# EAGLE schematic Mainboard (EAGLE 9.0.1)

## Sheet 1 of 4: ADC
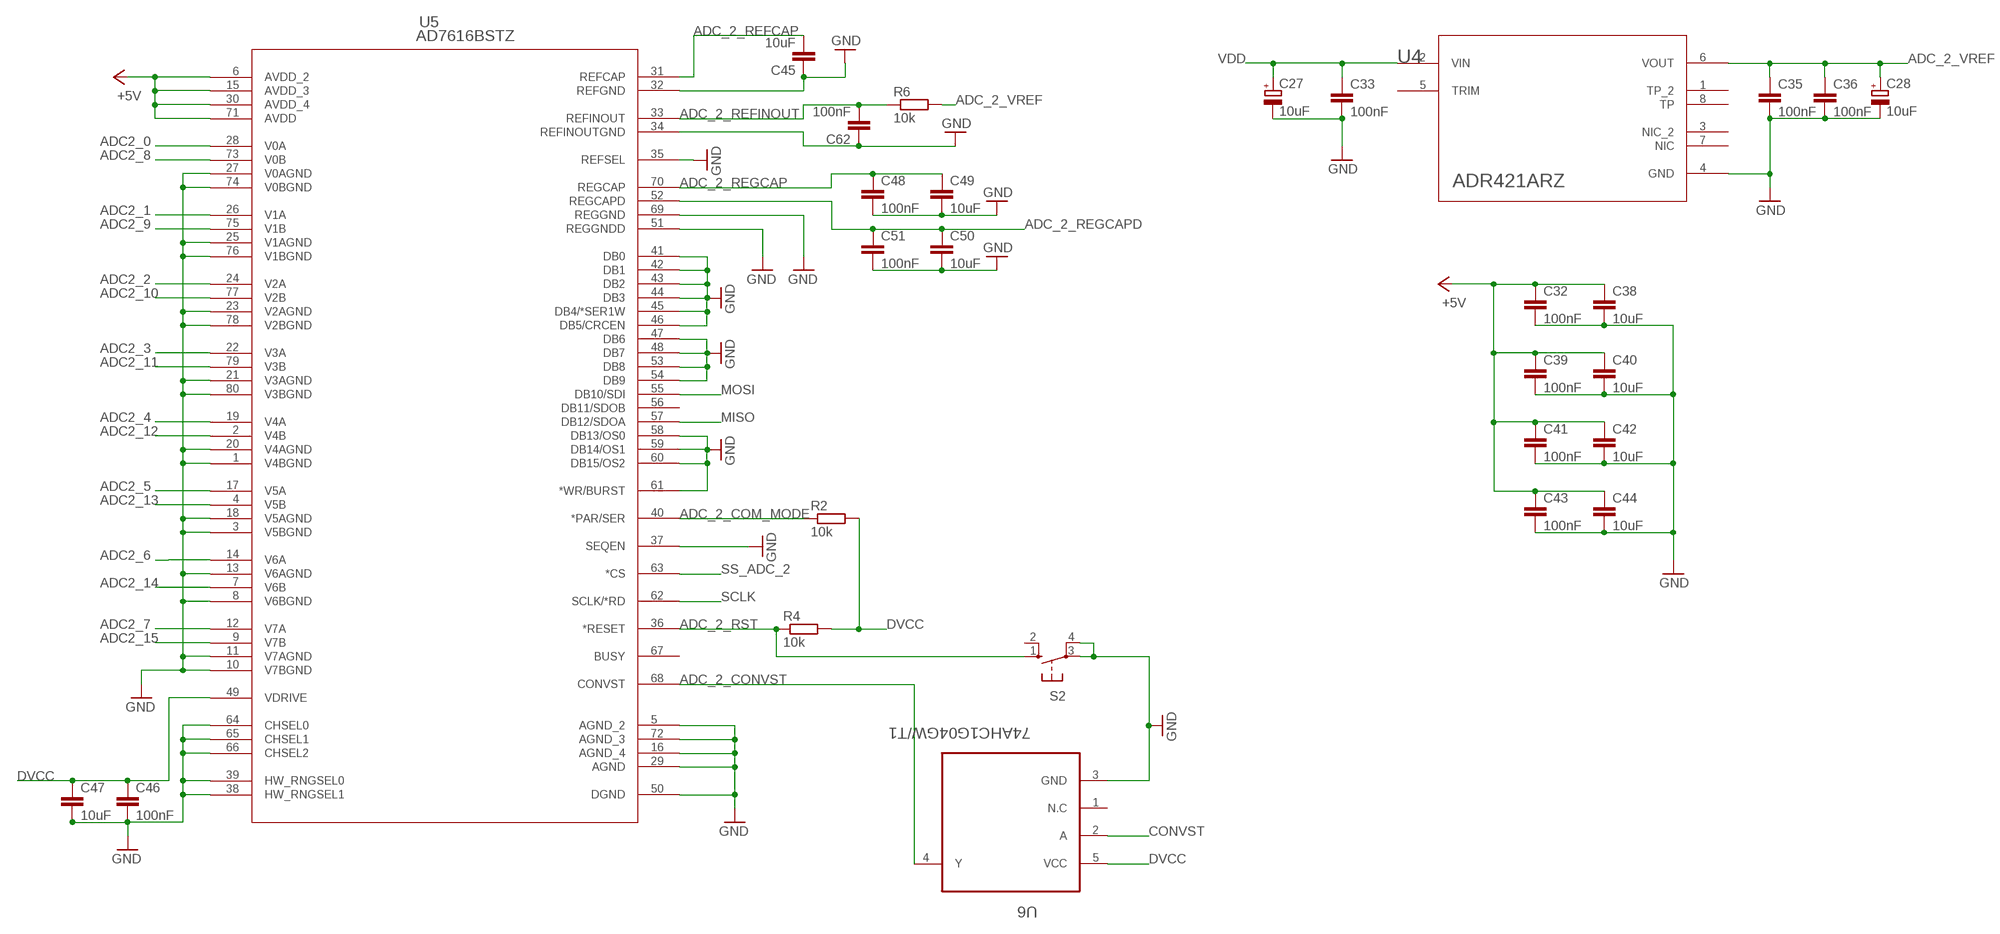
[diagram p0: schematic, sheet 1, part 1 of 2]
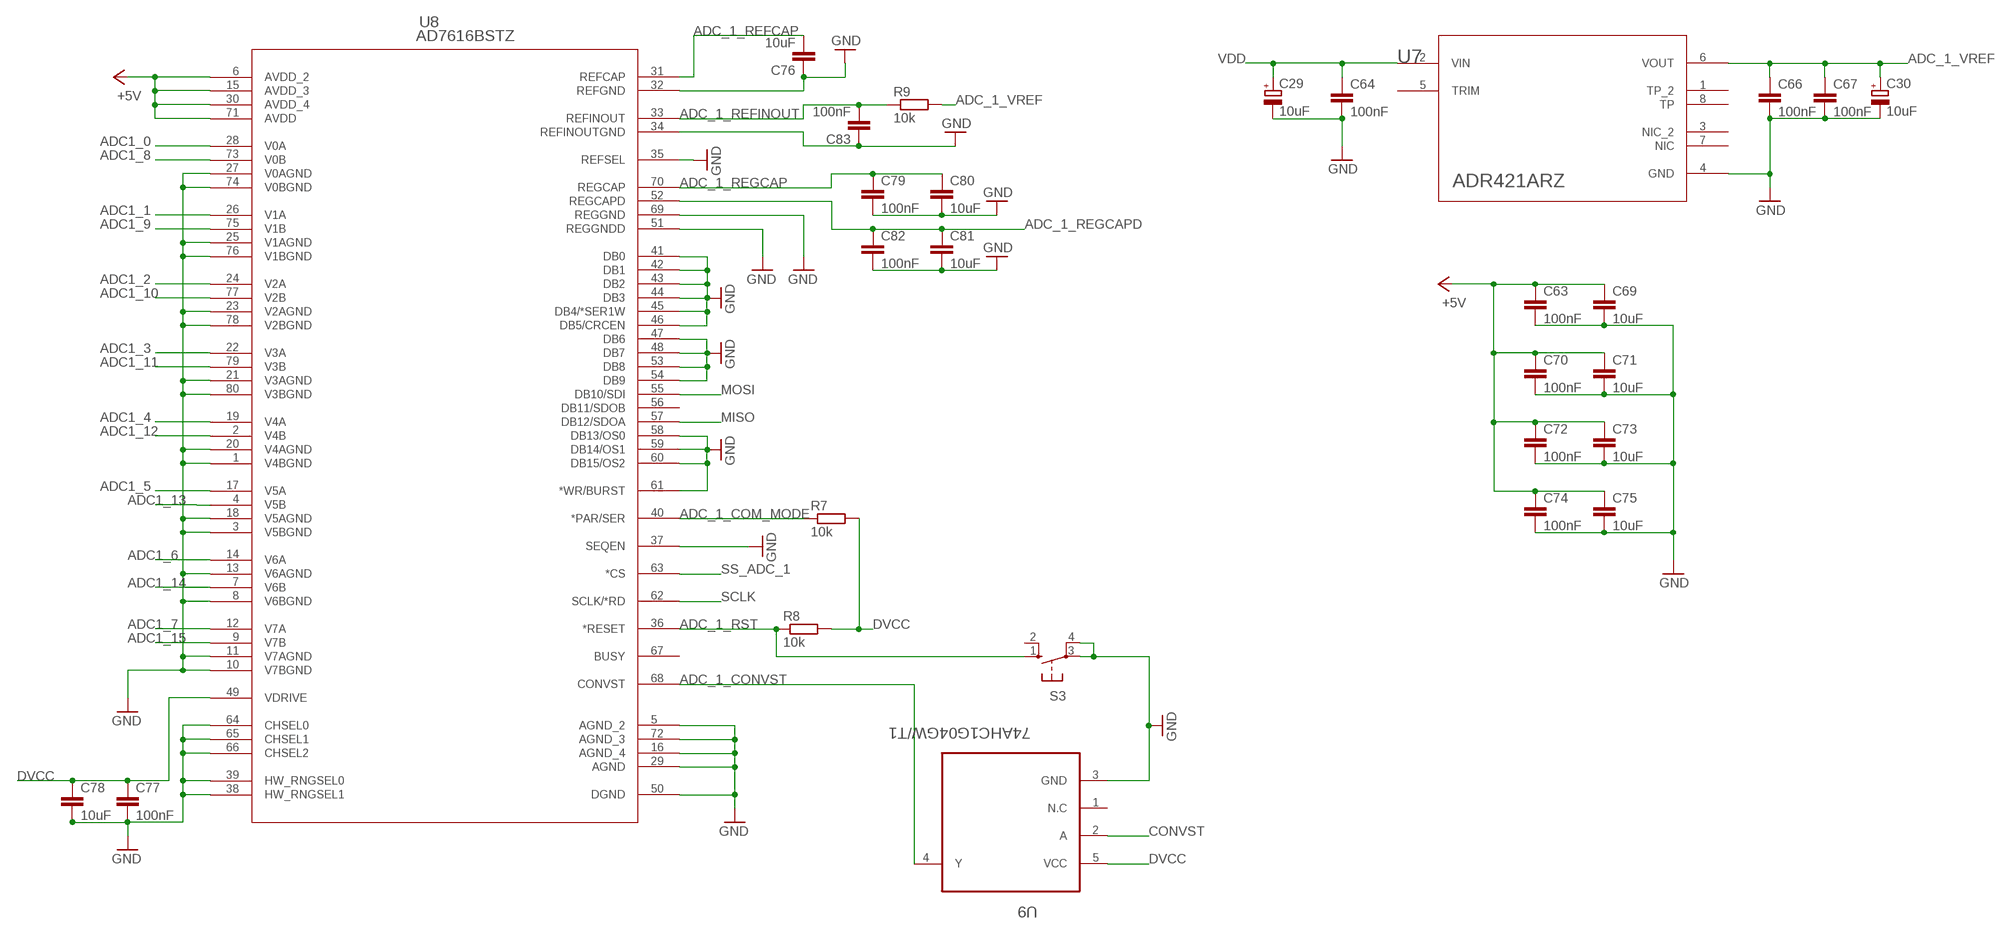
[diagram p1: schematic, sheet 1, part 2 of 2]

### Parts
C27  10uF  CPOL-EUSMCA  [SMC_A]
C28  10uF  CPOL-EUSMCA  [SMC_A]
C29  10uF  CPOL-EUSMCA  [SMC_A]
C30  10uF  CPOL-EUSMCA  [SMC_A]
C32  100nF  C-EUC0603  [C0603]
C33  100nF  C-EUC0603  [C0603]
C35  100nF  C-EUC0603  [C0603]
C36  100nF  C-EUC0603  [C0603]
C38  10uF  C-EUC0603  [C0603]
C39  100nF  C-EUC0603  [C0603]
C40  10uF  C-EUC0603  [C0603]
C41  100nF  C-EUC0603  [C0603]
C42  10uF  C-EUC0603  [C0603]
C43  100nF  C-EUC0603  [C0603]
C44  10uF  C-EUC0603  [C0603]
C45  10uF  C-EUC0603  [C0603]
C46  100nF  C-EUC0603  [C0603]
C47  10uF  C-EUC0603  [C0603]
C48  100nF  C-EUC0603  [C0603]
C49  10uF  C-EUC0603  [C0603]
C50  10uF  C-EUC0603  [C0603]
C51  100nF  C-EUC0603  [C0603]
C62  100nF  C-EUC0603  [C0603]
C63  100nF  C-EUC0603  [C0603]
C64  100nF  C-EUC0603  [C0603]
C66  100nF  C-EUC0603  [C0603]
C67  100nF  C-EUC0603  [C0603]
C69  10uF  C-EUC0603  [C0603]
C70  100nF  C-EUC0603  [C0603]
C71  10uF  C-EUC0603  [C0603]
C72  100nF  C-EUC0603  [C0603]
C73  10uF  C-EUC0603  [C0603]
C74  100nF  C-EUC0603  [C0603]
C75  10uF  C-EUC0603  [C0603]
C76  10uF  C-EUC0603  [C0603]
C77  100nF  C-EUC0603  [C0603]
C78  10uF  C-EUC0603  [C0603]
C79  100nF  C-EUC0603  [C0603]
C80  10uF  C-EUC0603  [C0603]
C81  10uF  C-EUC0603  [C0603]
C82  100nF  C-EUC0603  [C0603]
C83  100nF  C-EUC0603  [C0603]
R2  10k  R-EU_R0603  [R0603]
R4  10k  R-EU_R0603  [R0603]
R6  10k  R-EU_R0603  [R0603]
R7  10k  R-EU_R0603  [R0603]
R8  10k  R-EU_R0603  [R0603]
R9  10k  R-EU_R0603  [R0603]
S2  10-XX  [B3F-10XX]
S3  10-XX  [B3F-10XX]
U4  ADR421ARZ  ADR423ARZ  [R_8]
U5  AD7616BSTZ  [ST_80_2]
U6  74AHC1G04GW/T1  [SOT65P210X110-5N]
U7  ADR421ARZ  ADR423ARZ  [R_8]
U8  AD7616BSTZ  [ST_80_2]
U9  74AHC1G04GW/T1  [SOT65P210X110-5N]

### Nets
+5V: C32.1 C38.1 C39.1 C40.1 C41.1 C42.1 C43.1 C44.1 C63.1 C69.1 C70.1 C71.1 C72.1 C73.1 C74.1 C75.1 U5.6(AVDD_2) U5.15(AVDD_3) U5.30(AVDD_4) U5.71(AVDD) U8.6(AVDD_2) U8.15(AVDD_3) U8.30(AVDD_4) U8.71(AVDD) ; also sheet 3,4
ADC1_0: U8.28(V0A) ; also sheet 4
ADC1_1: U8.26(V1A) ; also sheet 4
ADC1_2: U8.24(V2A) ; also sheet 4
ADC1_3: U8.22(V3A) ; also sheet 4
ADC1_4: U8.19(V4A) ; also sheet 4
ADC1_5: U8.17(V5A) ; also sheet 4
ADC1_6: U8.14(V6A) ; also sheet 4
ADC1_7: U8.12(V7A) ; also sheet 4
ADC1_8: U8.73(V0B) ; also sheet 4
ADC1_9: U8.75(V1B) ; also sheet 4
ADC1_10: U8.77(V2B) ; also sheet 4
ADC1_11: U8.79(V3B) ; also sheet 4
ADC1_12: U8.2(V4B) ; also sheet 4
ADC1_13: U8.4(V5B) ; also sheet 4
ADC1_14: U8.7(V6B) ; also sheet 4
ADC1_15: U8.9(V7B) ; also sheet 4
ADC2_0: U5.28(V0A) ; also sheet 4
ADC2_1: U5.26(V1A) ; also sheet 4
ADC2_2: U5.24(V2A) ; also sheet 4
ADC2_3: U5.22(V3A) ; also sheet 4
ADC2_4: U5.19(V4A) ; also sheet 4
ADC2_5: U5.17(V5A) ; also sheet 4
ADC2_6: U5.14(V6A) ; also sheet 4
ADC2_7: U5.12(V7A) ; also sheet 4
ADC2_8: U5.73(V0B) ; also sheet 4
ADC2_9: U5.75(V1B) ; also sheet 4
ADC2_10: U5.77(V2B) ; also sheet 4
ADC2_11: U5.79(V3B) ; also sheet 4
ADC2_12: U5.2(V4B) ; also sheet 4
ADC2_13: U5.4(V5B) ; also sheet 4
ADC2_14: U5.7(V6B) ; also sheet 4
ADC2_15: U5.9(V7B) ; also sheet 4
ADC_1_COM_MODE: R7.1 U8.40(*PAR/SER)
ADC_1_CONVST: U8.68(CONVST) U9.4(Y)
ADC_1_REFCAP: C76.2 U8.31(REFCAP)
ADC_1_REFINOUT: C83.2 R9.1 U8.33(REFINOUT)
ADC_1_REGCAP: C79.1 C80.1 U8.70(REGCAP)
ADC_1_REGCAPD: C81.1 C82.1 U8.52(REGCAPD)
ADC_1_RST: R8.1 S3.1(S) U8.36(*RESET)
ADC_1_VREF: C30.+ C66.1 C67.1 R9.2 U7.6(VOUT)
ADC_2_COM_MODE: R2.1 U5.40(*PAR/SER)
ADC_2_CONVST: U5.68(CONVST) U6.4(Y)
ADC_2_REFCAP: C45.2 U5.31(REFCAP)
ADC_2_REFINOUT: C62.2 R6.1 U5.33(REFINOUT)
ADC_2_REGCAP: C48.1 C49.1 U5.70(REGCAP)
ADC_2_REGCAPD: C50.1 C51.1 U5.52(REGCAPD)
ADC_2_RST: R4.1 S2.1(S) U5.36(*RESET)
ADC_2_VREF: C28.+ C35.1 C36.1 R6.2 U4.6(VOUT)
CONVST: U6.2(A) U9.2(A) ; also sheet 4
DVCC: C46.1 C47.1 C77.1 C78.1 R2.2 R4.2 R7.2 R8.2 U5.49(VDRIVE) U6.5(VCC) U8.49(VDRIVE) U9.5(VCC) ; also sheet 2,3,4
GND: C27.- C28.- C29.- C30.- C32.2 C33.2 C35.2 C36.2 C38.2 C39.2 C40.2 C41.2 C42.2 C43.2 C44.2 C45.1 C46.2 C47.2 C48.2 C49.2 C50.2 C51.2 C62.1 C63.2 C64.2 C66.2 C67.2 C69.2 C70.2 C71.2 C72.2 C73.2 C74.2 C75.2 C76.1 C77.2 C78.2 C79.2 C80.2 C81.2 C82.2 C83.1 S2.3(P) S2.4(P1) S3.3(P) S3.4(P1) U4.4(GND) U5.1(V4BGND) U5.3(V5BGND) U5.5(AGND_2) U5.8(V6BGND) U5.10(V7BGND) U5.11(V7AGND) U5.13(V6AGND) U5.16(AGND_4) U5.18(V5AGND) U5.20(V4AGND) U5.21(V3AGND) U5.23(V2AGND) U5.25(V1AGND) U5.27(V0AGND) U5.29(AGND) U5.32(REFGND) U5.34(REFINOUTGND) U5.35(REFSEL) U5.37(SEQEN) U5.38(HW_RNGSEL1) U5.39(HW_RNGSEL0) U5.41(DB0) U5.42(DB1) U5.43(DB2) U5.44(DB3) U5.45(DB4/*SER1W) U5.46(DB5/CRCEN) U5.47(DB6) U5.48(DB7) U5.50(DGND) U5.51(REGGNDD) U5.53(DB8) U5.54(DB9) U5.58(DB13/OS0) U5.59(DB14/OS1) U5.60(DB15/OS2) U5.61(*WR/BURST) U5.64(CHSEL0) U5.65(CHSEL1) U5.66(CHSEL2) U5.69(REGGND) U5.72(AGND_3) U5.74(V0BGND) U5.76(V1BGND) U5.78(V2BGND) U5.80(V3BGND) U6.3(GND) U7.4(GND) U8.1(V4BGND) U8.3(V5BGND) U8.5(AGND_2) U8.8(V6BGND) U8.10(V7BGND) U8.11(V7AGND) U8.13(V6AGND) U8.16(AGND_4) U8.18(V5AGND) U8.20(V4AGND) U8.21(V3AGND) U8.23(V2AGND) U8.25(V1AGND) U8.27(V0AGND) U8.29(AGND) U8.32(REFGND) U8.34(REFINOUTGND) U8.35(REFSEL) U8.37(SEQEN) U8.38(HW_RNGSEL1) U8.39(HW_RNGSEL0) U8.41(DB0) U8.42(DB1) U8.43(DB2) U8.44(DB3) U8.45(DB4/*SER1W) U8.46(DB5/CRCEN) U8.47(DB6) U8.48(DB7) U8.50(DGND) U8.51(REGGNDD) U8.53(DB8) U8.54(DB9) U8.58(DB13/OS0) U8.59(DB14/OS1) U8.60(DB15/OS2) U8.61(*WR/BURST) U8.64(CHSEL0) U8.65(CHSEL1) U8.66(CHSEL2) U8.69(REGGND) U8.72(AGND_3) U8.74(V0BGND) U8.76(V1BGND) U8.78(V2BGND) U8.80(V3BGND) U9.3(GND) ; also sheet 2,3,4
MISO: U5.57(DB12/SDOA) U8.57(DB12/SDOA) ; also sheet 2,3,4
MOSI: U5.55(DB10/SDI) U8.55(DB10/SDI) ; also sheet 2,3,4
SCLK: U5.62(SCLK/*RD) U8.62(SCLK/*RD) ; also sheet 2,3,4
SS_ADC_1: U8.63(*CS) ; also sheet 4
SS_ADC_2: U5.63(*CS) ; also sheet 4
VDD: C27.+ C29.+ C33.1 C64.1 U4.2(VIN) U7.2(VIN) ; also sheet 2,4
Unconnected: S2.2(S1) S3.2(S1) U4.1(TP_2) U4.3(NIC_2) U4.5(TRIM) U4.7(NIC) U4.8(TP) U5.56(DB11/SDOB) U5.67(BUSY) U6.1(N.C) U7.1(TP_2) U7.3(NIC_2) U7.5(TRIM) U7.7(NIC) U7.8(TP) U8.56(DB11/SDOB) U8.67(BUSY) U9.1(N.C)

## Sheet 2 of 4: DAC
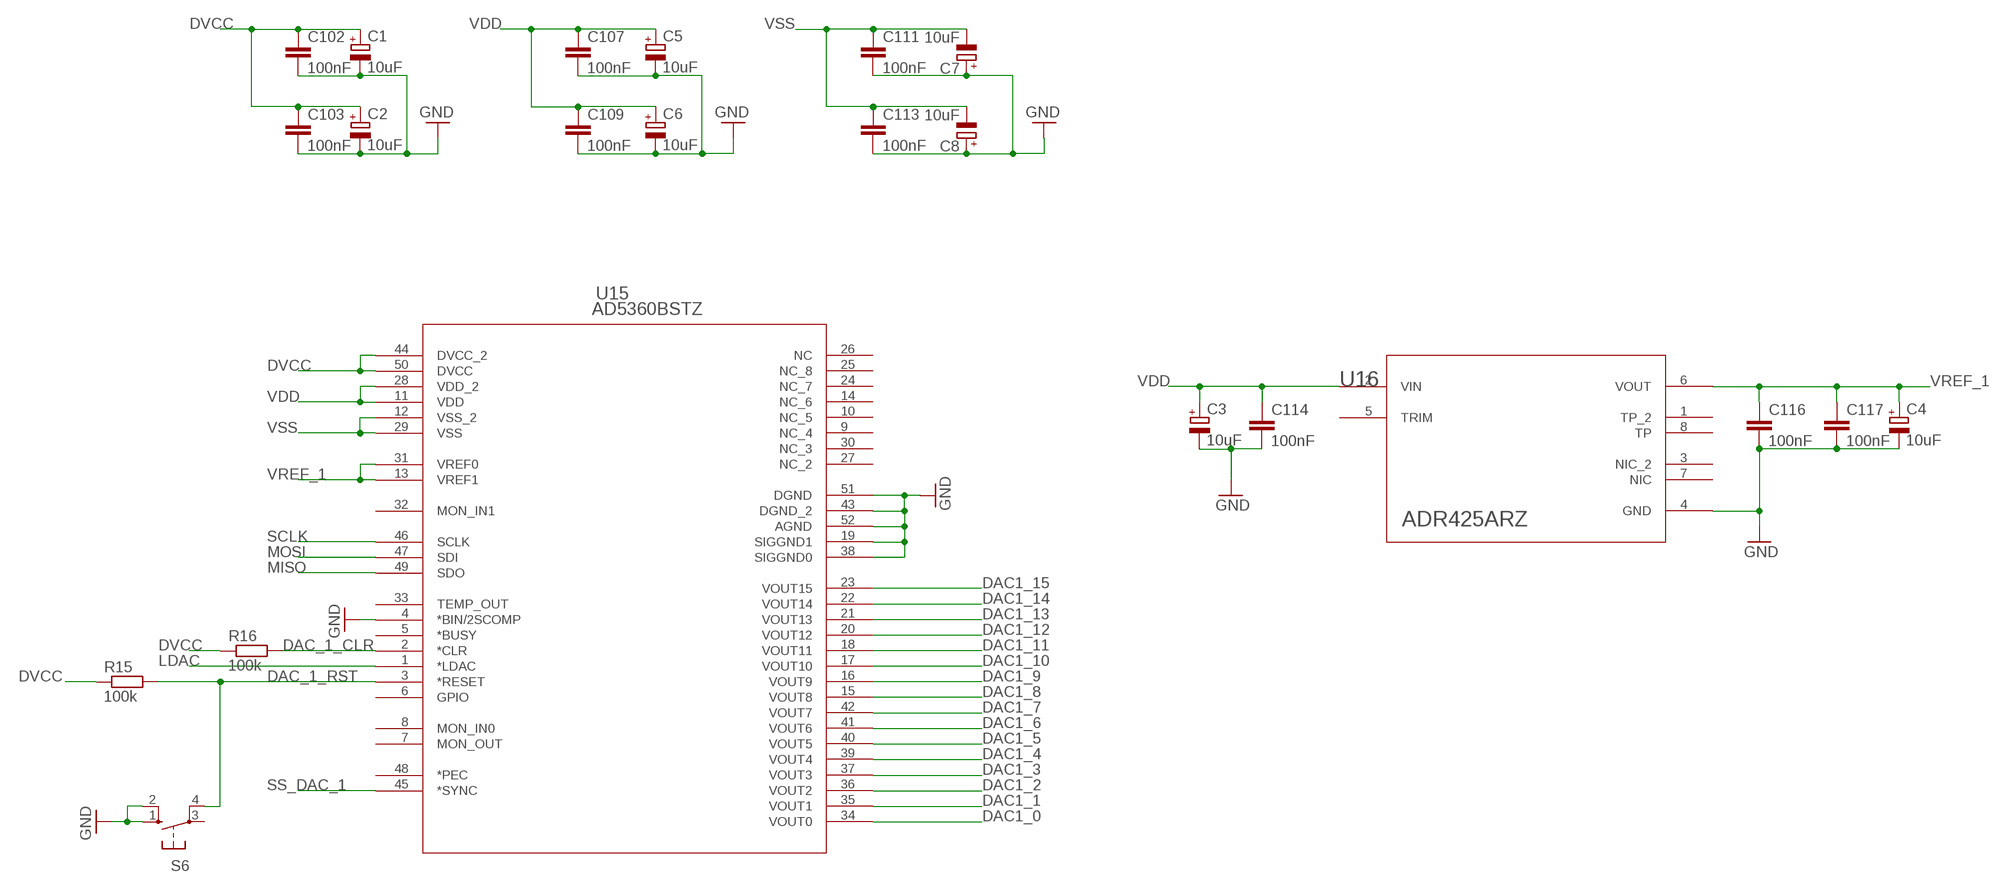
[diagram p2: schematic, sheet 2, part 1 of 2]
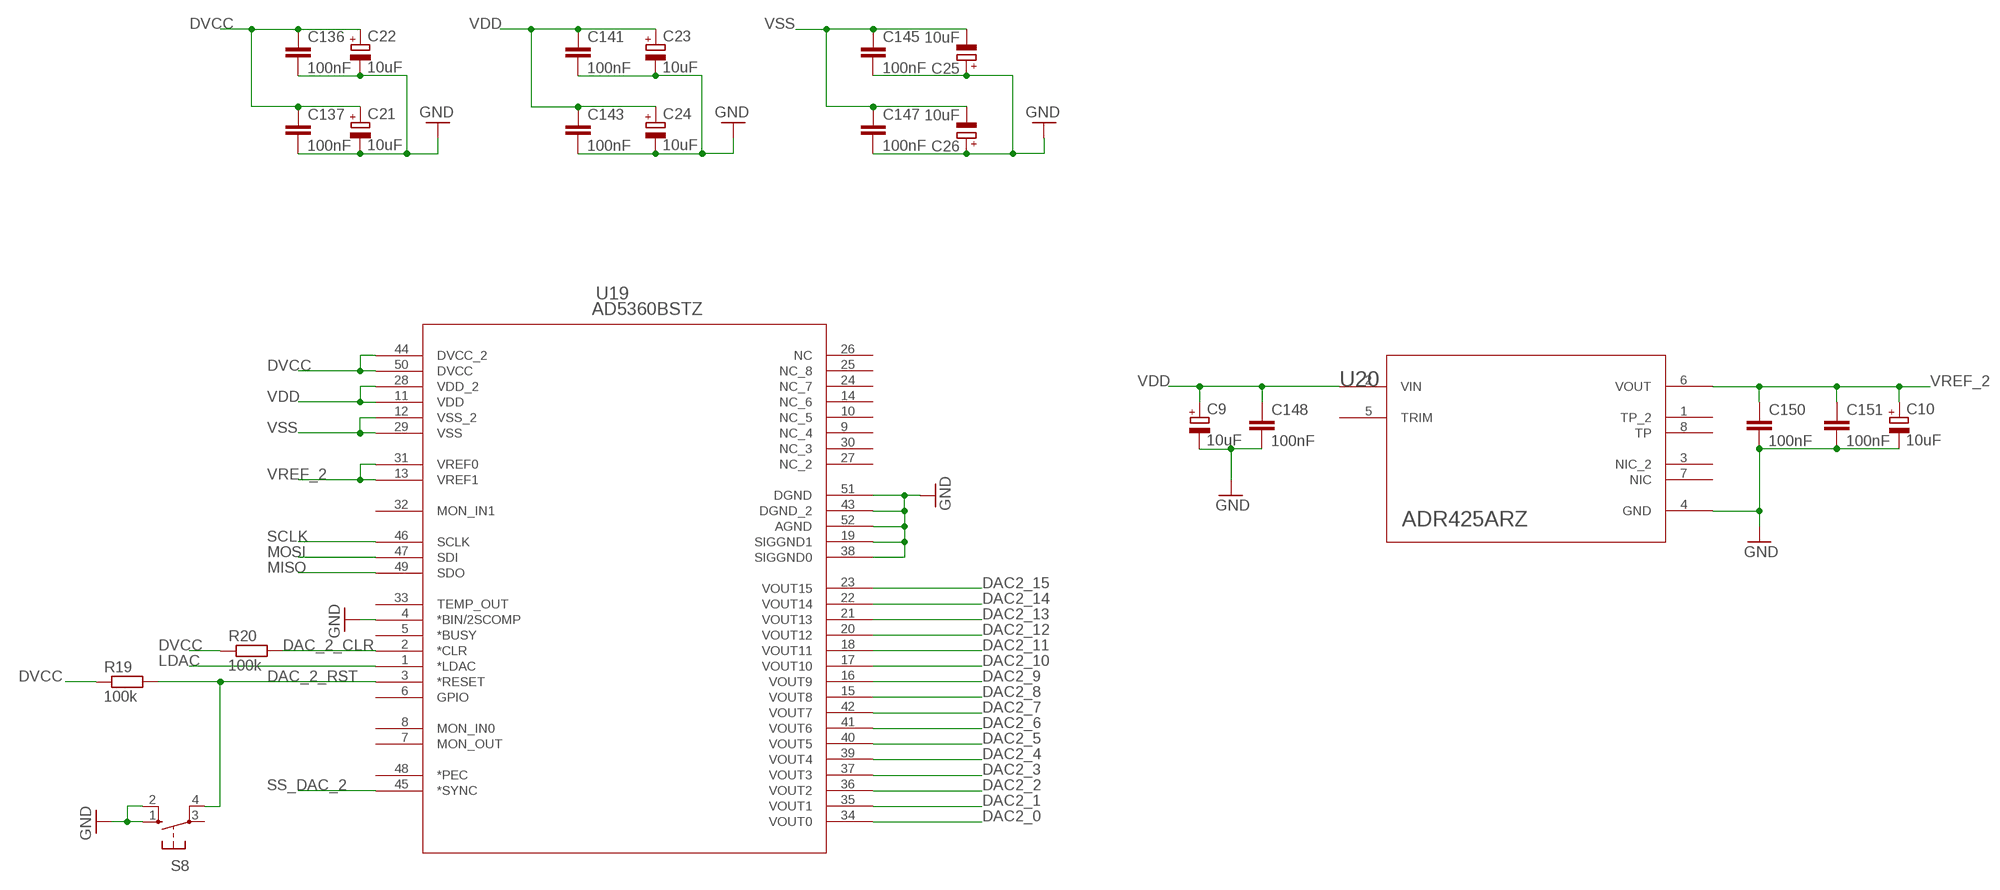
[diagram p3: schematic, sheet 2, part 2 of 2]

### Parts
C1  10uF  CPOL-EUSMCA  [SMC_A]
C2  10uF  CPOL-EUSMCA  [SMC_A]
C3  10uF  CPOL-EUSMCA  [SMC_A]
C4  10uF  CPOL-EUSMCA  [SMC_A]
C5  10uF  CPOL-EUSMCA  [SMC_A]
C6  10uF  CPOL-EUSMCA  [SMC_A]
C7  10uF  CPOL-EUSMCA  [SMC_A]
C8  10uF  CPOL-EUSMCA  [SMC_A]
C9  10uF  CPOL-EUSMCA  [SMC_A]
C10  10uF  CPOL-EUSMCA  [SMC_A]
C21  10uF  CPOL-EUSMCA  [SMC_A]
C22  10uF  CPOL-EUSMCA  [SMC_A]
C23  10uF  CPOL-EUSMCA  [SMC_A]
C24  10uF  CPOL-EUSMCA  [SMC_A]
C25  10uF  CPOL-EUSMCA  [SMC_A]
C26  10uF  CPOL-EUSMCA  [SMC_A]
C102  100nF  C-EUC0603  [C0603]
C103  100nF  C-EUC0603  [C0603]
C107  100nF  C-EUC0603  [C0603]
C109  100nF  C-EUC0603  [C0603]
C111  100nF  C-EUC0603  [C0603]
C113  100nF  C-EUC0603  [C0603]
C114  100nF  C-EUC0603  [C0603]
C116  100nF  C-EUC0603  [C0603]
C117  100nF  C-EUC0603  [C0603]
C136  100nF  C-EUC0603  [C0603]
C137  100nF  C-EUC0603  [C0603]
C141  100nF  C-EUC0603  [C0603]
C143  100nF  C-EUC0603  [C0603]
C145  100nF  C-EUC0603  [C0603]
C147  100nF  C-EUC0603  [C0603]
C148  100nF  C-EUC0603  [C0603]
C150  100nF  C-EUC0603  [C0603]
C151  100nF  C-EUC0603  [C0603]
R15  100k  R-EU_R0603  [R0603]
R16  100k  R-EU_R0603  [R0603]
R19  100k  R-EU_R0603  [R0603]
R20  100k  R-EU_R0603  [R0603]
S6  10-XX  [B3F-10XX]
S8  10-XX  [B3F-10XX]
U15  AD5360BSTZ  [ST_52]
U16  ADR425ARZ  ADR423ARZ  [R_8]
U19  AD5360BSTZ  [ST_52]
U20  ADR425ARZ  ADR423ARZ  [R_8]

### Nets
DAC1_0: U15.34(VOUT0) ; also sheet 4
DAC1_1: U15.35(VOUT1) ; also sheet 4
DAC1_2: U15.36(VOUT2) ; also sheet 4
DAC1_3: U15.37(VOUT3) ; also sheet 4
DAC1_4: U15.39(VOUT4) ; also sheet 4
DAC1_5: U15.40(VOUT5) ; also sheet 4
DAC1_6: U15.41(VOUT6) ; also sheet 4
DAC1_7: U15.42(VOUT7) ; also sheet 4
DAC1_8: U15.15(VOUT8) ; also sheet 4
DAC1_9: U15.16(VOUT9) ; also sheet 4
DAC1_10: U15.17(VOUT10) ; also sheet 4
DAC1_11: U15.18(VOUT11) ; also sheet 4
DAC1_12: U15.20(VOUT12) ; also sheet 4
DAC1_13: U15.21(VOUT13) ; also sheet 4
DAC1_14: U15.22(VOUT14) ; also sheet 4
DAC1_15: U15.23(VOUT15) ; also sheet 4
DAC2_0: U19.34(VOUT0) ; also sheet 4
DAC2_1: U19.35(VOUT1) ; also sheet 4
DAC2_2: U19.36(VOUT2) ; also sheet 4
DAC2_3: U19.37(VOUT3) ; also sheet 4
DAC2_4: U19.39(VOUT4) ; also sheet 4
DAC2_5: U19.40(VOUT5) ; also sheet 4
DAC2_6: U19.41(VOUT6) ; also sheet 4
DAC2_7: U19.42(VOUT7) ; also sheet 4
DAC2_8: U19.15(VOUT8) ; also sheet 4
DAC2_9: U19.16(VOUT9) ; also sheet 4
DAC2_10: U19.17(VOUT10) ; also sheet 4
DAC2_11: U19.18(VOUT11) ; also sheet 4
DAC2_12: U19.20(VOUT12) ; also sheet 4
DAC2_13: U19.21(VOUT13) ; also sheet 4
DAC2_14: U19.22(VOUT14) ; also sheet 4
DAC2_15: U19.23(VOUT15) ; also sheet 4
DAC_1_CLR: R16.2 U15.2(*CLR)
DAC_1_RST: R15.2 S6.4(P1) U15.3(*RESET)
DAC_2_CLR: R20.2 U19.2(*CLR)
DAC_2_RST: R19.2 S8.4(P1) U19.3(*RESET)
DVCC: C1.+ C2.+ C21.+ C22.+ C102.1 C103.1 C136.1 C137.1 R15.1 R16.1 R19.1 R20.1 U15.44(DVCC_2) U15.50(DVCC) U19.44(DVCC_2) U19.50(DVCC) ; also sheet 1,3,4
GND: C1.- C2.- C3.- C4.- C5.- C6.- C7.+ C8.+ C9.- C10.- C21.- C22.- C23.- C24.- C25.+ C26.+ C102.2 C103.2 C107.2 C109.2 C111.2 C113.2 C114.2 C116.2 C117.2 C136.2 C137.2 C141.2 C143.2 C145.2 C147.2 C148.2 C150.2 C151.2 S6.1(S) S6.2(S1) S8.1(S) S8.2(S1) U15.4(*BIN/2SCOMP) U15.19(SIGGND1) U15.38(SIGGND0) U15.43(DGND_2) U15.51(DGND) U15.52(AGND) U16.4(GND) U19.4(*BIN/2SCOMP) U19.19(SIGGND1) U19.38(SIGGND0) U19.43(DGND_2) U19.51(DGND) U19.52(AGND) U20.4(GND) ; also sheet 1,3,4
LDAC: U15.1(*LDAC) U19.1(*LDAC) ; also sheet 4
MISO: U15.49(SDO) U19.49(SDO) ; also sheet 1,3,4
MOSI: U15.47(SDI) U19.47(SDI) ; also sheet 1,3,4
SCLK: U15.46(SCLK) U19.46(SCLK) ; also sheet 1,3,4
SS_DAC_1: U15.45(*SYNC) ; also sheet 4
SS_DAC_2: U19.45(*SYNC) ; also sheet 4
VDD: C3.+ C5.+ C6.+ C9.+ C23.+ C24.+ C107.1 C109.1 C114.1 C141.1 C143.1 C148.1 U15.11(VDD) U15.28(VDD_2) U16.2(VIN) U19.11(VDD) U19.28(VDD_2) U20.2(VIN) ; also sheet 1,4
VREF_1: C4.+ C116.1 C117.1 U15.13(VREF1) U15.31(VREF0) U16.6(VOUT)
VREF_2: C10.+ C150.1 C151.1 U19.13(VREF1) U19.31(VREF0) U20.6(VOUT)
VSS: C7.- C8.- C25.- C26.- C111.1 C113.1 C145.1 C147.1 U15.12(VSS_2) U15.29(VSS) U19.12(VSS_2) U19.29(VSS) ; also sheet 4
Unconnected: S6.3(P) S8.3(P) U15.5(*BUSY) U15.6(GPIO) U15.7(MON_OUT) U15.8(MON_IN0) U15.9(NC_4) U15.10(NC_5) U15.14(NC_6) U15.24(NC_7) U15.25(NC_8) U15.26(NC) U15.27(NC_2) U15.30(NC_3) U15.32(MON_IN1) U15.33(TEMP_OUT) U15.48(*PEC) U16.1(TP_2) U16.3(NIC_2) U16.5(TRIM) U16.7(NIC) U16.8(TP) U19.5(*BUSY) U19.6(GPIO) U19.7(MON_OUT) U19.8(MON_IN0) U19.9(NC_4) U19.10(NC_5) U19.14(NC_6) U19.24(NC_7) U19.25(NC_8) U19.26(NC) U19.27(NC_2) U19.30(NC_3) U19.32(MON_IN1) U19.33(TEMP_OUT) U19.48(*PEC) U20.1(TP_2) U20.3(NIC_2) U20.5(TRIM) U20.7(NIC) U20.8(TP)

## Sheet 3 of 4: LoadCell
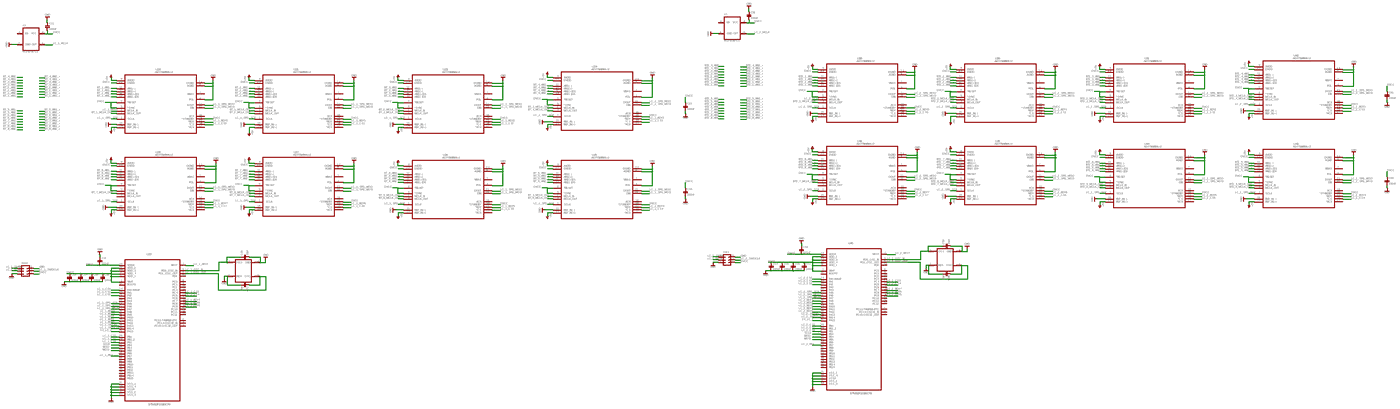
[diagram p4: schematic, sheet 3, overview]
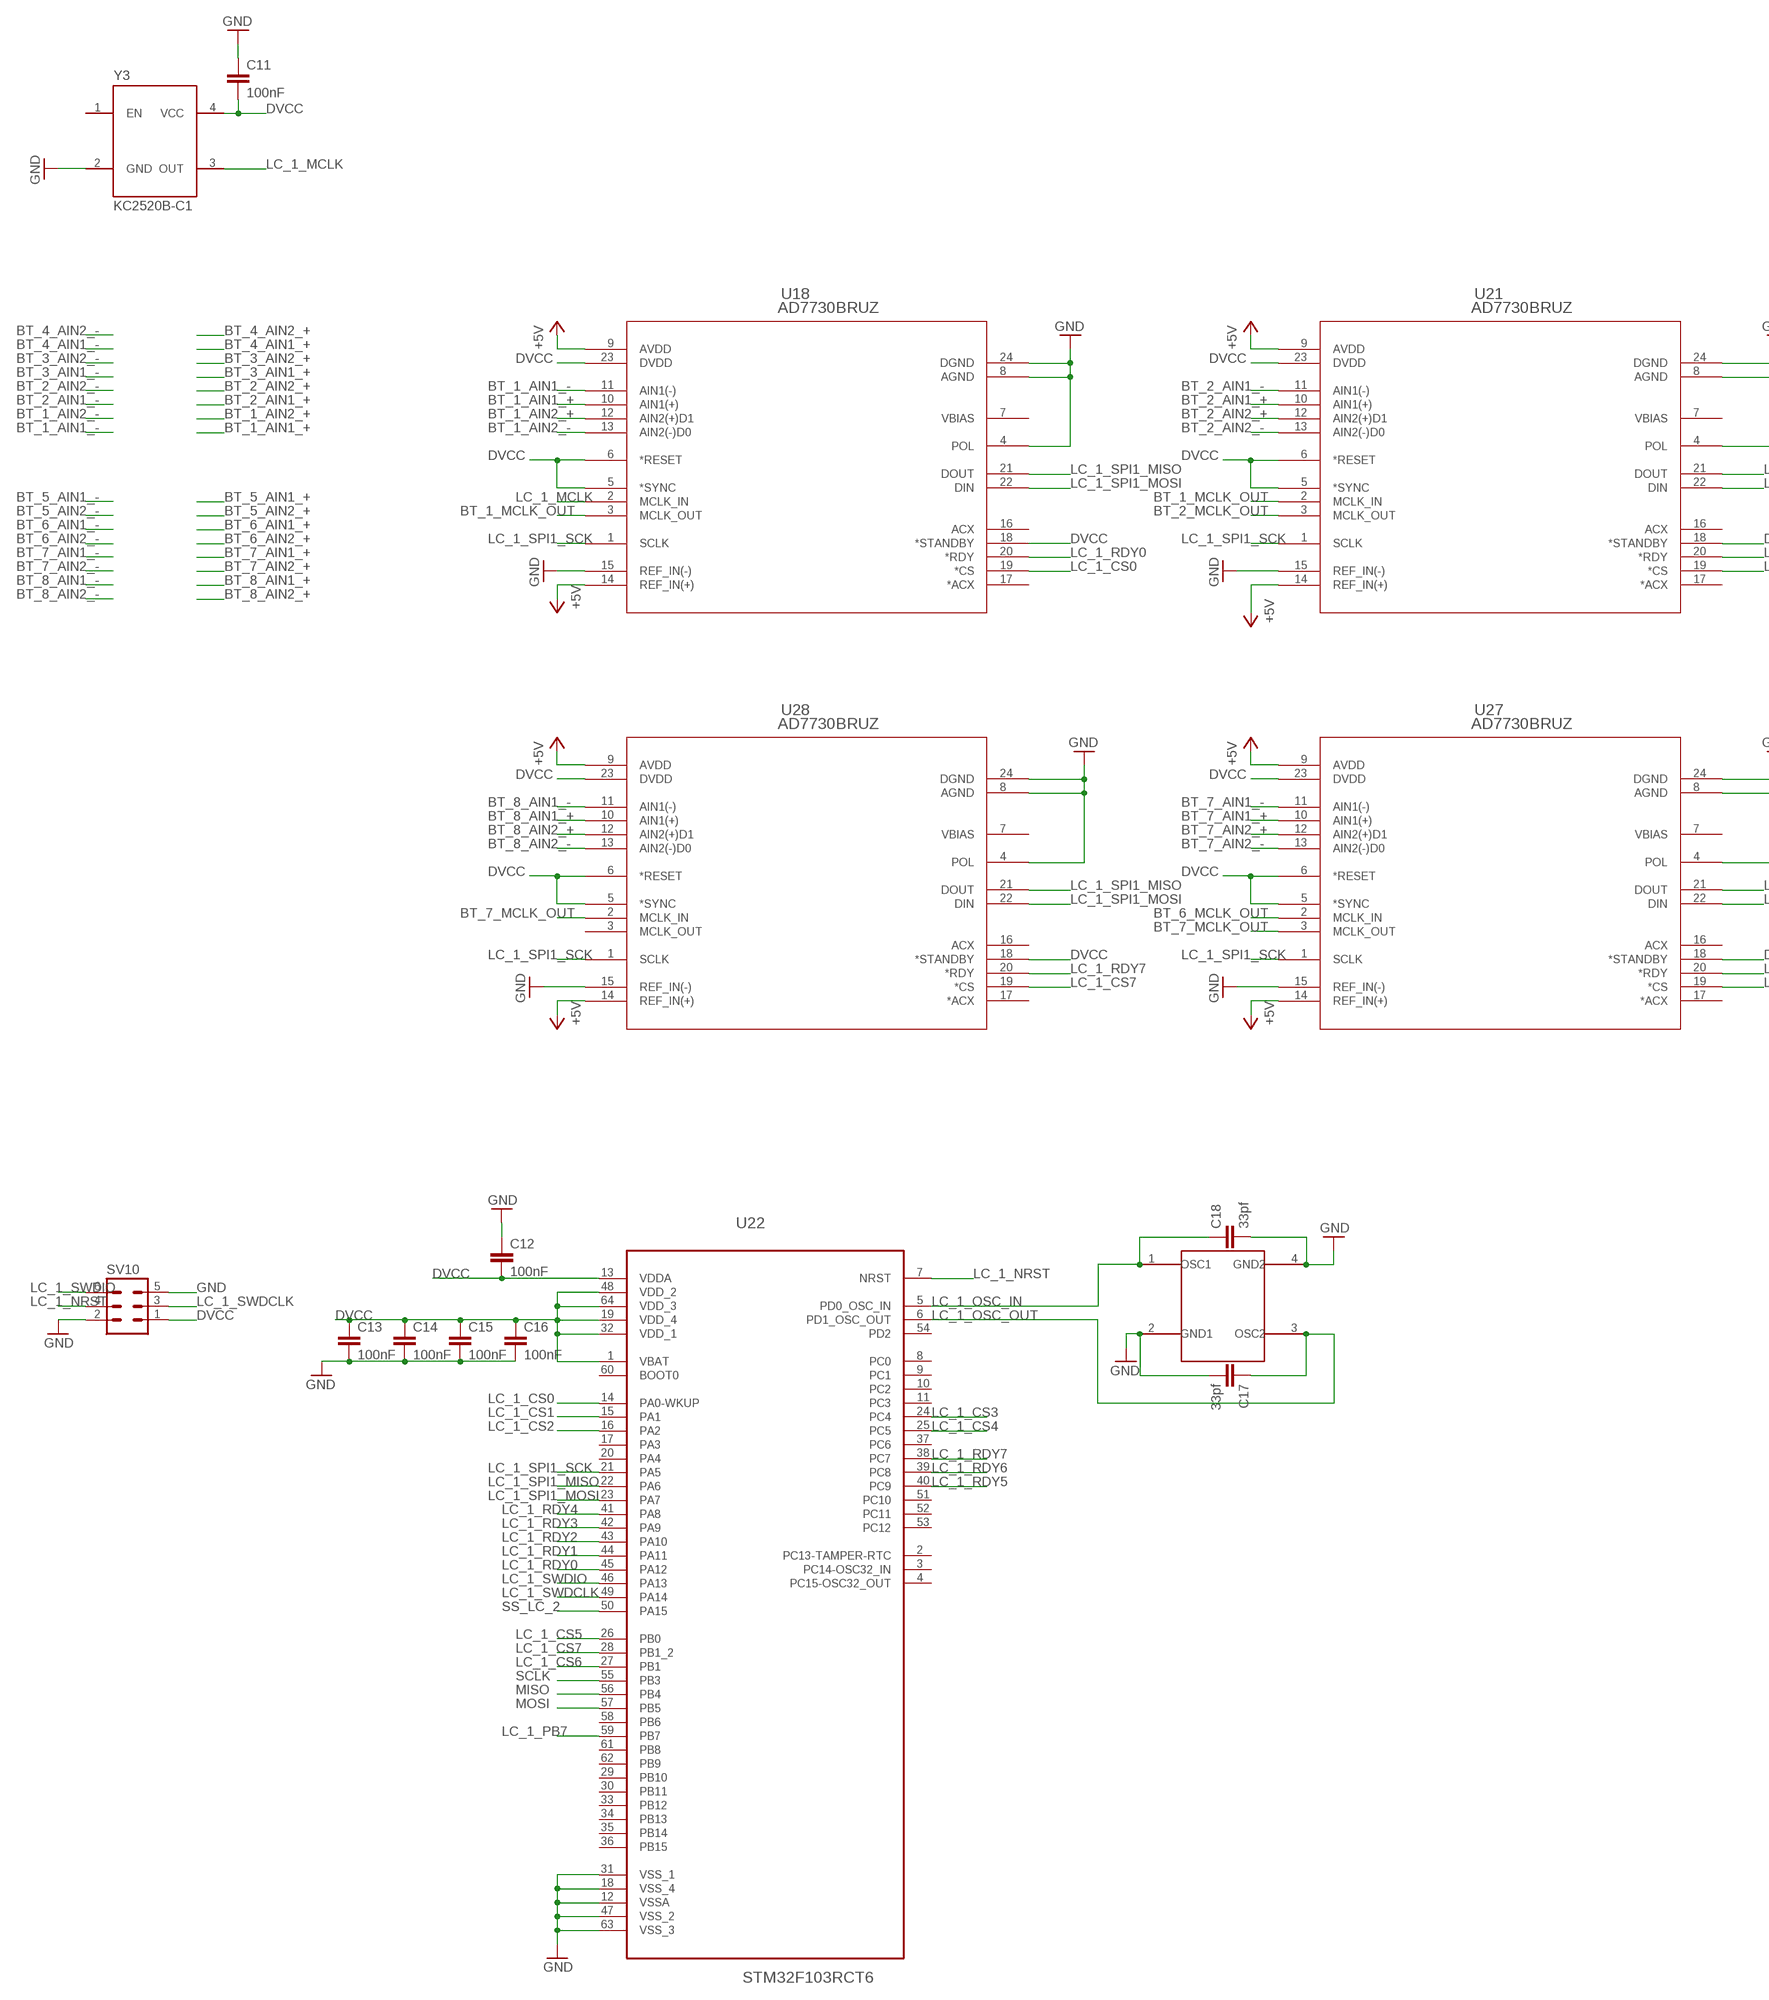
[diagram p5: schematic, sheet 3, part 1 of 4]
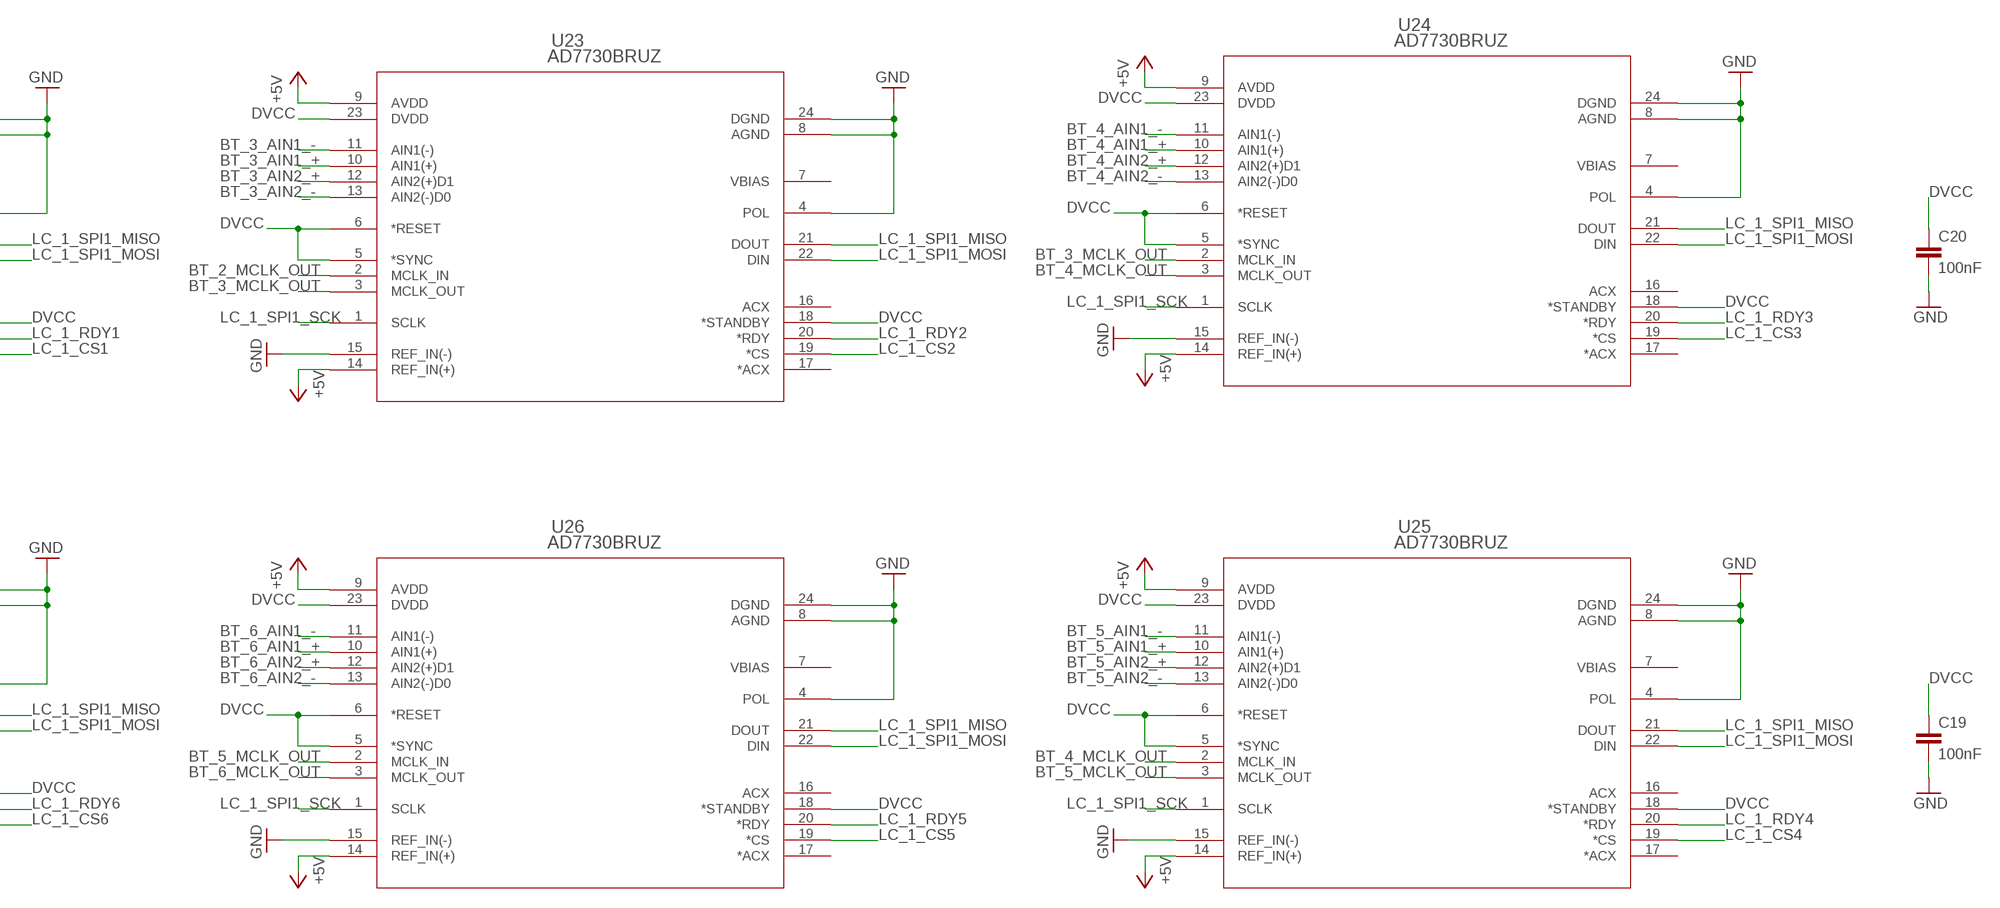
[diagram p6: schematic, sheet 3, part 2 of 4]
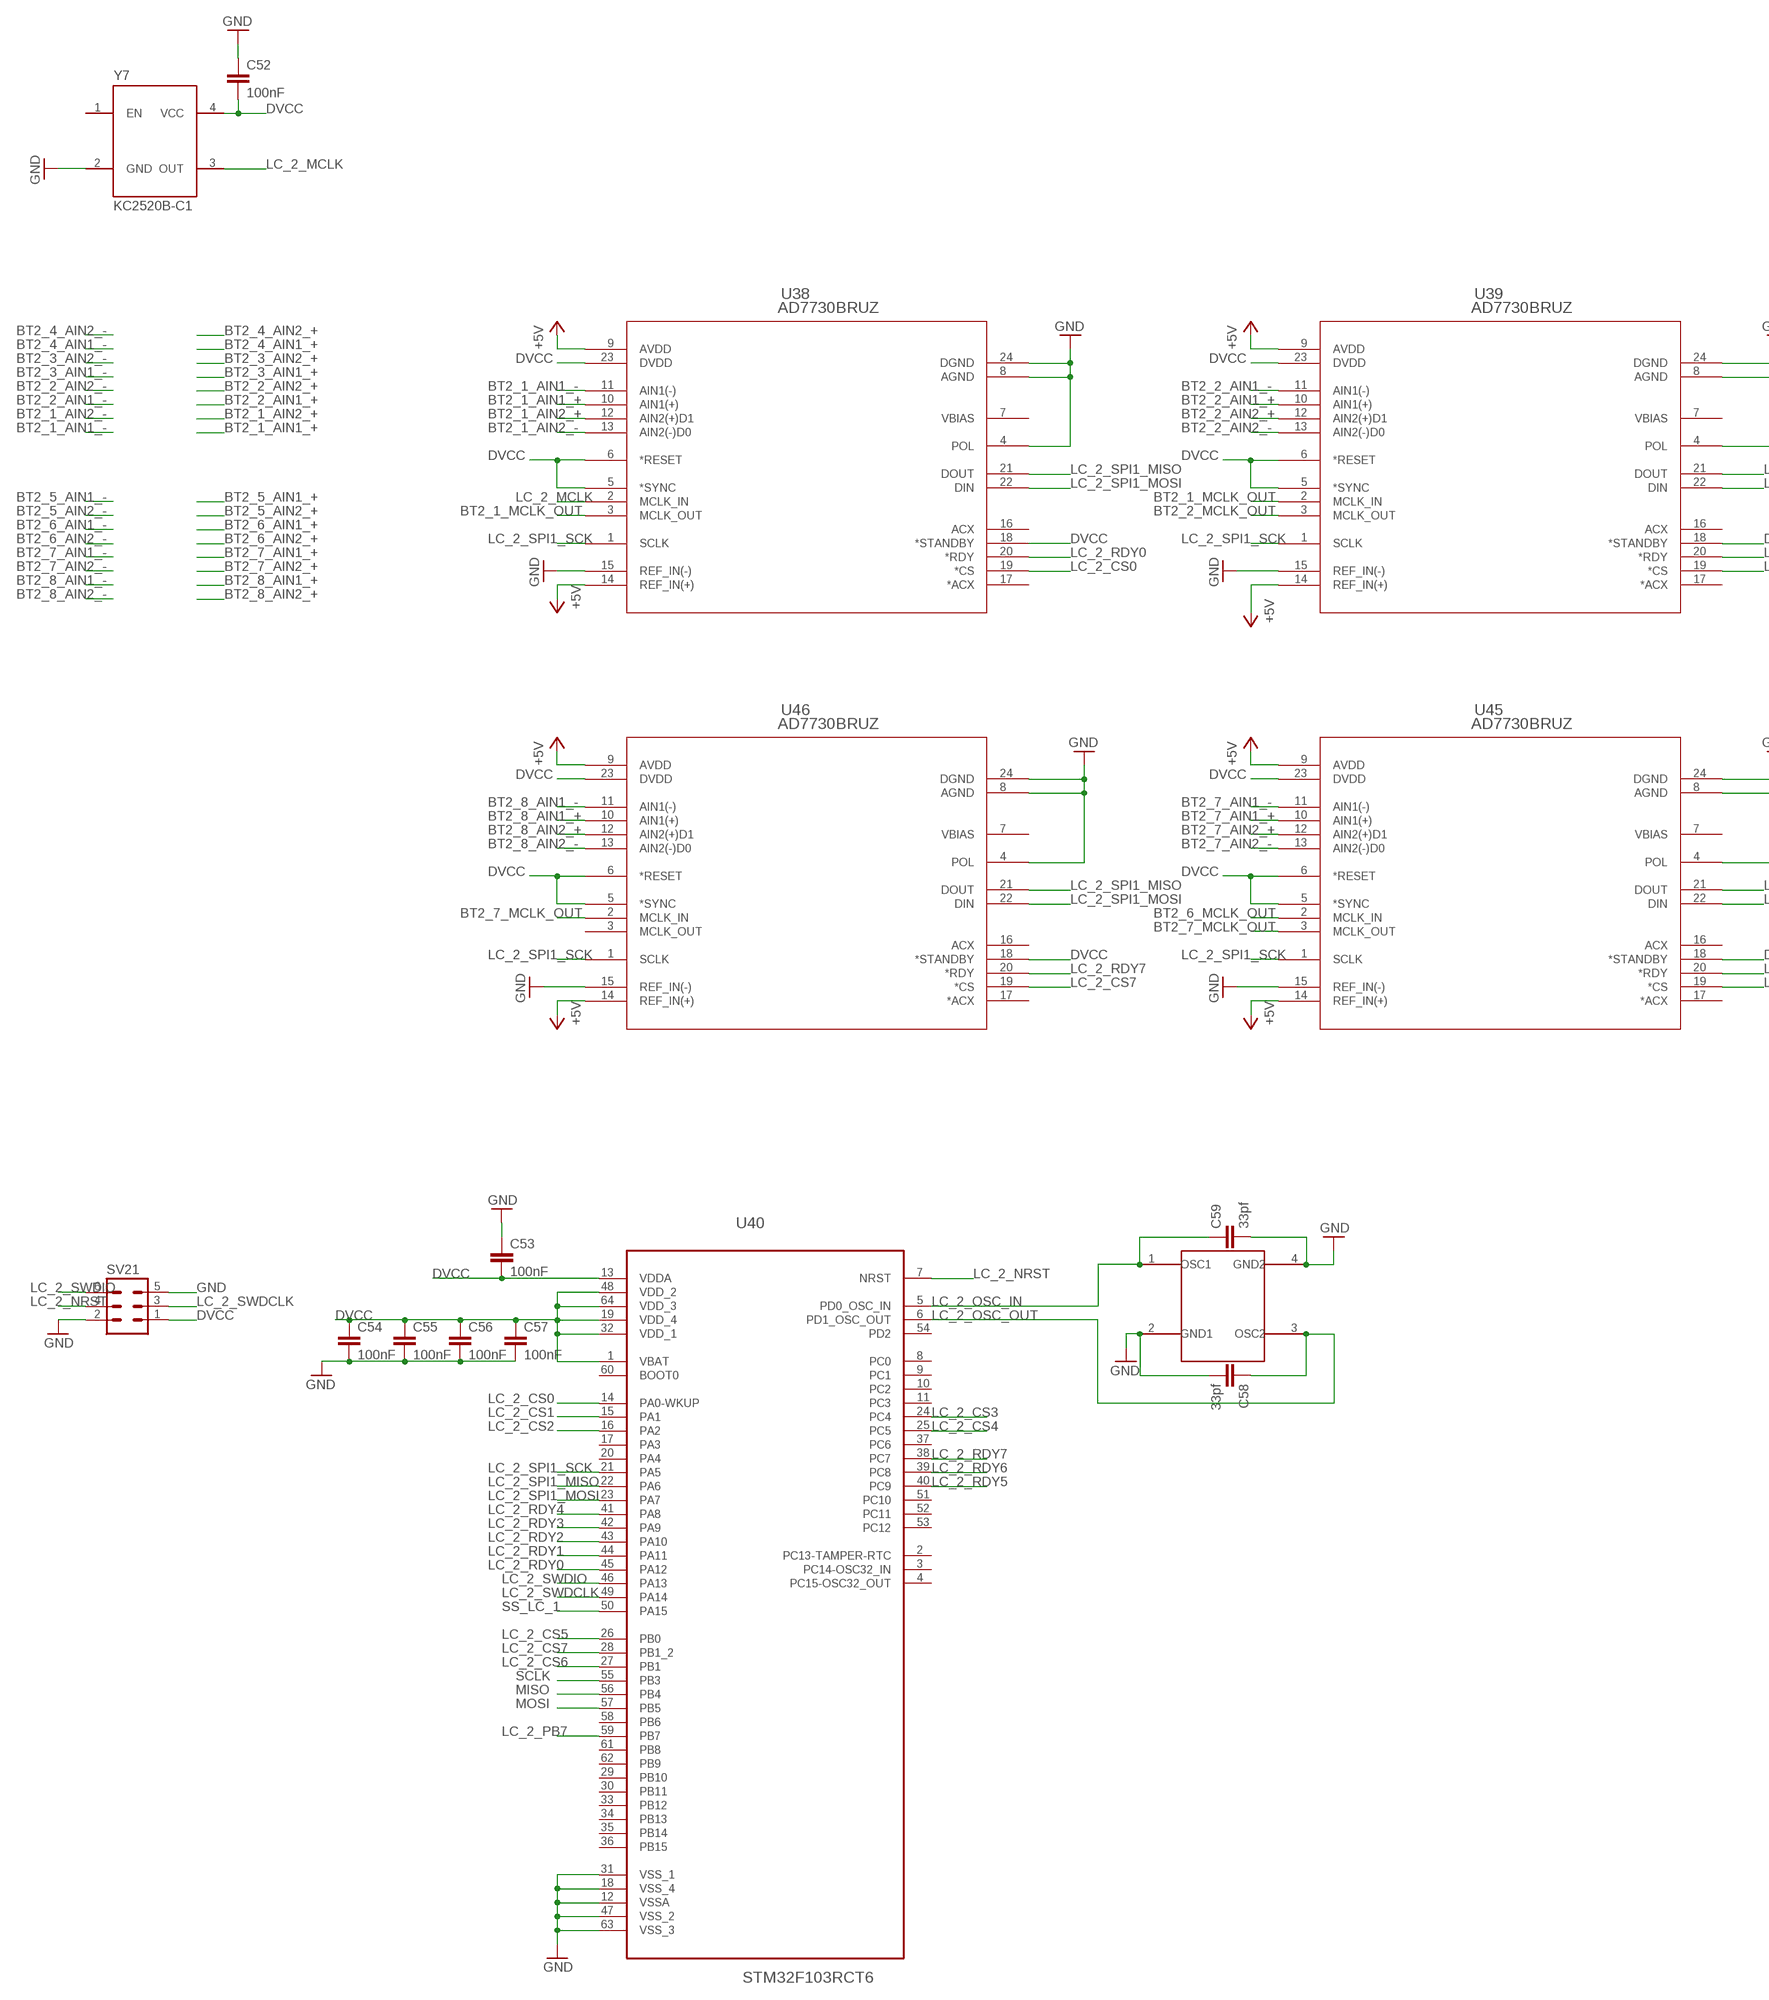
[diagram p7: schematic, sheet 3, part 3 of 4]
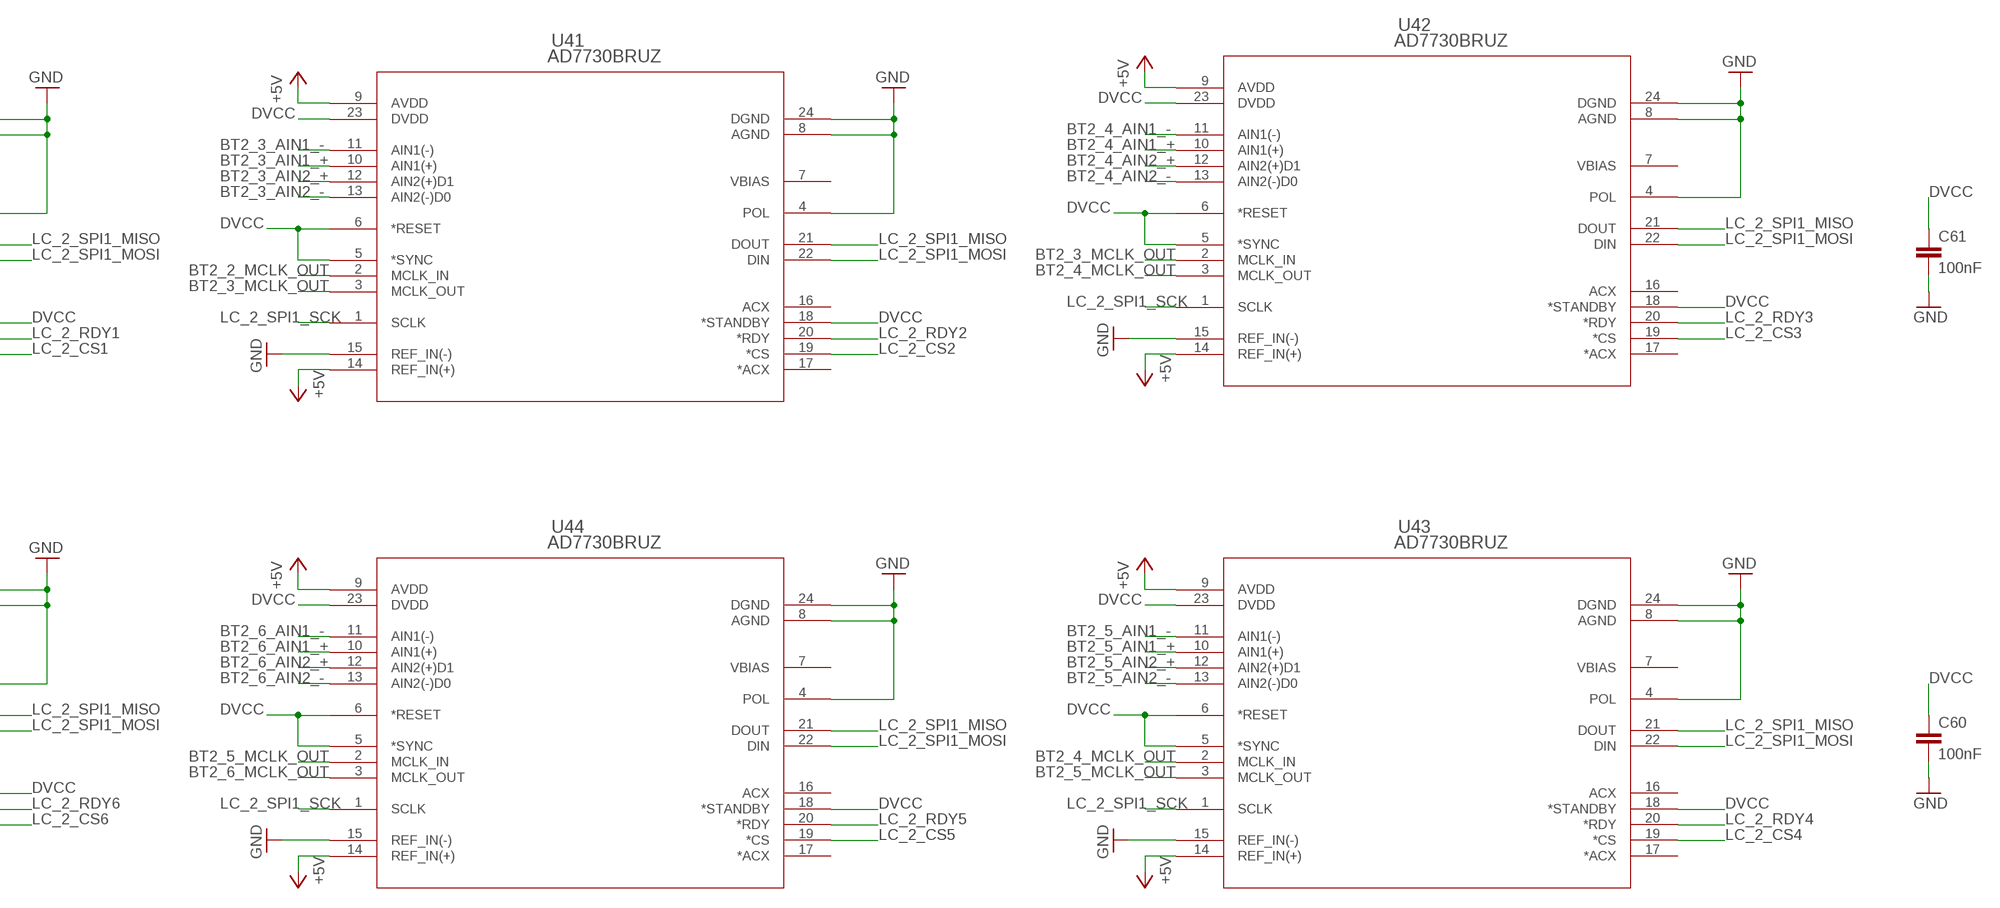
[diagram p8: schematic, sheet 3, part 4 of 4]

### Parts
C11  100nF  C-EUC0603  [C0603]
C12  100nF  C-EUC0603  [C0603]
C13  100nF  C-EUC0603  [C0603]
C14  100nF  C-EUC0603  [C0603]
C15  100nF  C-EUC0603  [C0603]
C16  100nF  C-EUC0603  [C0603]
C17  33pf  C-EUC0603  [C0603]
C18  33pf  C-EUC0603  [C0603]
C19  100nF  C-EUC0603  [C0603]
C20  100nF  C-EUC0603  [C0603]
C52  100nF  C-EUC0603  [C0603]
C53  100nF  C-EUC0603  [C0603]
C54  100nF  C-EUC0603  [C0603]
C55  100nF  C-EUC0603  [C0603]
C56  100nF  C-EUC0603  [C0603]
C57  100nF  C-EUC0603  [C0603]
C58  33pf  C-EUC0603  [C0603]
C59  33pf  C-EUC0603  [C0603]
C60  100nF  C-EUC0603  [C0603]
C61  100nF  C-EUC0603  [C0603]
SV10  MA03-2  [MA03-2]
SV21  MA03-2  [MA03-2]
U18  AD7730BRUZ  [RU_24]
U21  AD7730BRUZ  [RU_24]
U22  STM32F103RCT6  [QFP50P1200X1200X160-64N]
U23  AD7730BRUZ  [RU_24]
U24  AD7730BRUZ  [RU_24]
U25  AD7730BRUZ  [RU_24]
U26  AD7730BRUZ  [RU_24]
U27  AD7730BRUZ  [RU_24]
U28  AD7730BRUZ  [RU_24]
U38  AD7730BRUZ  [RU_24]
U39  AD7730BRUZ  [RU_24]
U40  STM32F103RCT6  [QFP50P1200X1200X160-64N]
U41  AD7730BRUZ  [RU_24]
U42  AD7730BRUZ  [RU_24]
U43  AD7730BRUZ  [RU_24]
U44  AD7730BRUZ  [RU_24]
U45  AD7730BRUZ  [RU_24]
U46  AD7730BRUZ  [RU_24]
Y3  KC2520B-C1  [KC2520B-C1]
Y4  ABM3B  [ABM3B]
Y7  KC2520B-C1  [KC2520B-C1]
Y8  ABM3B  [ABM3B]

### Nets
+5V: U18.9(AVDD) U18.14(REF_IN(+)) U21.9(AVDD) U21.14(REF_IN(+)) U23.9(AVDD) U23.14(REF_IN(+)) U24.9(AVDD) U24.14(REF_IN(+)) U25.9(AVDD) U25.14(REF_IN(+)) U26.9(AVDD) U26.14(REF_IN(+)) U27.9(AVDD) U27.14(REF_IN(+)) U28.9(AVDD) U28.14(REF_IN(+)) U38.9(AVDD) U38.14(REF_IN(+)) U39.9(AVDD) U39.14(REF_IN(+)) U41.9(AVDD) U41.14(REF_IN(+)) U42.9(AVDD) U42.14(REF_IN(+)) U43.9(AVDD) U43.14(REF_IN(+)) U44.9(AVDD) U44.14(REF_IN(+)) U45.9(AVDD) U45.14(REF_IN(+)) U46.9(AVDD) U46.14(REF_IN(+)) ; also sheet 1,4
BT2_1_AIN1_+: U38.10(AIN1(+)) ; also sheet 4
BT2_1_AIN1_-: U38.11(AIN1(-)) ; also sheet 4
BT2_1_AIN2_+: U38.12(AIN2(+)D1) ; also sheet 4
BT2_1_AIN2_-: U38.13(AIN2(-)D0) ; also sheet 4
BT2_1_MCLK_OUT: U38.3(MCLK_OUT) U39.2(MCLK_IN)
BT2_2_AIN1_+: U39.10(AIN1(+)) ; also sheet 4
BT2_2_AIN1_-: U39.11(AIN1(-)) ; also sheet 4
BT2_2_AIN2_+: U39.12(AIN2(+)D1) ; also sheet 4
BT2_2_AIN2_-: U39.13(AIN2(-)D0) ; also sheet 4
BT2_2_MCLK_OUT: U39.3(MCLK_OUT) U41.2(MCLK_IN)
BT2_3_AIN1_+: U41.10(AIN1(+)) ; also sheet 4
BT2_3_AIN1_-: U41.11(AIN1(-)) ; also sheet 4
BT2_3_AIN2_+: U41.12(AIN2(+)D1) ; also sheet 4
BT2_3_AIN2_-: U41.13(AIN2(-)D0) ; also sheet 4
BT2_3_MCLK_OUT: U41.3(MCLK_OUT) U42.2(MCLK_IN)
BT2_4_AIN1_+: U42.10(AIN1(+)) ; also sheet 4
BT2_4_AIN1_-: U42.11(AIN1(-)) ; also sheet 4
BT2_4_AIN2_+: U42.12(AIN2(+)D1) ; also sheet 4
BT2_4_AIN2_-: U42.13(AIN2(-)D0) ; also sheet 4
BT2_4_MCLK_OUT: U42.3(MCLK_OUT) U43.2(MCLK_IN)
BT2_5_AIN1_+: U43.10(AIN1(+)) ; also sheet 4
BT2_5_AIN1_-: U43.11(AIN1(-)) ; also sheet 4
BT2_5_AIN2_+: U43.12(AIN2(+)D1) ; also sheet 4
BT2_5_AIN2_-: U43.13(AIN2(-)D0) ; also sheet 4
BT2_5_MCLK_OUT: U43.3(MCLK_OUT) U44.2(MCLK_IN)
BT2_6_AIN1_+: U44.10(AIN1(+)) ; also sheet 4
BT2_6_AIN1_-: U44.11(AIN1(-)) ; also sheet 4
BT2_6_AIN2_+: U44.12(AIN2(+)D1) ; also sheet 4
BT2_6_AIN2_-: U44.13(AIN2(-)D0) ; also sheet 4
BT2_6_MCLK_OUT: U44.3(MCLK_OUT) U45.2(MCLK_IN)
BT2_7_AIN1_+: U45.10(AIN1(+)) ; also sheet 4
BT2_7_AIN1_-: U45.11(AIN1(-)) ; also sheet 4
BT2_7_AIN2_+: U45.12(AIN2(+)D1) ; also sheet 4
BT2_7_AIN2_-: U45.13(AIN2(-)D0) ; also sheet 4
BT2_7_MCLK_OUT: U45.3(MCLK_OUT) U46.2(MCLK_IN)
BT2_8_AIN1_+: U46.10(AIN1(+)) ; also sheet 4
BT2_8_AIN1_-: U46.11(AIN1(-)) ; also sheet 4
BT2_8_AIN2_+: U46.12(AIN2(+)D1) ; also sheet 4
BT2_8_AIN2_-: U46.13(AIN2(-)D0) ; also sheet 4
BT_1_AIN1_+: U18.10(AIN1(+)) ; also sheet 4
BT_1_AIN1_-: U18.11(AIN1(-)) ; also sheet 4
BT_1_AIN2_+: U18.12(AIN2(+)D1) ; also sheet 4
BT_1_AIN2_-: U18.13(AIN2(-)D0) ; also sheet 4
BT_1_MCLK_OUT: U18.3(MCLK_OUT) U21.2(MCLK_IN)
BT_2_AIN1_+: U21.10(AIN1(+)) ; also sheet 4
BT_2_AIN1_-: U21.11(AIN1(-)) ; also sheet 4
BT_2_AIN2_+: U21.12(AIN2(+)D1) ; also sheet 4
BT_2_AIN2_-: U21.13(AIN2(-)D0) ; also sheet 4
BT_2_MCLK_OUT: U21.3(MCLK_OUT) U23.2(MCLK_IN)
BT_3_AIN1_+: U23.10(AIN1(+)) ; also sheet 4
BT_3_AIN1_-: U23.11(AIN1(-)) ; also sheet 4
BT_3_AIN2_+: U23.12(AIN2(+)D1) ; also sheet 4
BT_3_AIN2_-: U23.13(AIN2(-)D0) ; also sheet 4
BT_3_MCLK_OUT: U23.3(MCLK_OUT) U24.2(MCLK_IN)
BT_4_AIN1_+: U24.10(AIN1(+)) ; also sheet 4
BT_4_AIN1_-: U24.11(AIN1(-)) ; also sheet 4
BT_4_AIN2_+: U24.12(AIN2(+)D1) ; also sheet 4
BT_4_AIN2_-: U24.13(AIN2(-)D0) ; also sheet 4
BT_4_MCLK_OUT: U24.3(MCLK_OUT) U25.2(MCLK_IN)
BT_5_AIN1_+: U25.10(AIN1(+)) ; also sheet 4
BT_5_AIN1_-: U25.11(AIN1(-)) ; also sheet 4
BT_5_AIN2_+: U25.12(AIN2(+)D1) ; also sheet 4
BT_5_AIN2_-: U25.13(AIN2(-)D0) ; also sheet 4
BT_5_MCLK_OUT: U25.3(MCLK_OUT) U26.2(MCLK_IN)
BT_6_AIN1_+: U26.10(AIN1(+)) ; also sheet 4
BT_6_AIN1_-: U26.11(AIN1(-)) ; also sheet 4
BT_6_AIN2_+: U26.12(AIN2(+)D1) ; also sheet 4
BT_6_AIN2_-: U26.13(AIN2(-)D0) ; also sheet 4
BT_6_MCLK_OUT: U26.3(MCLK_OUT) U27.2(MCLK_IN)
BT_7_AIN1_+: U27.10(AIN1(+)) ; also sheet 4
BT_7_AIN1_-: U27.11(AIN1(-)) ; also sheet 4
BT_7_AIN2_+: U27.12(AIN2(+)D1) ; also sheet 4
BT_7_AIN2_-: U27.13(AIN2(-)D0) ; also sheet 4
BT_7_MCLK_OUT: U27.3(MCLK_OUT) U28.2(MCLK_IN)
BT_8_AIN1_+: U28.10(AIN1(+)) ; also sheet 4
BT_8_AIN1_-: U28.11(AIN1(-)) ; also sheet 4
BT_8_AIN2_+: U28.12(AIN2(+)D1) ; also sheet 4
BT_8_AIN2_-: U28.13(AIN2(-)D0) ; also sheet 4
DVCC: C11.2 C12.2 C13.1 C14.1 C15.1 C16.1 C19.1 C20.1 C52.2 C53.2 C54.1 C55.1 C56.1 C57.1 C60.1 C61.1 SV10.1 SV21.1 U18.5(*SYNC) U18.6(*RESET) U18.18(*STANDBY) U18.23(DVDD) U21.5(*SYNC) U21.6(*RESET) U21.18(*STANDBY) U21.23(DVDD) U22.1(VBAT) U22.13(VDDA) U22.19(VDD_4) U22.32(VDD_1) U22.48(VDD_2) U22.64(VDD_3) U23.5(*SYNC) U23.6(*RESET) U23.18(*STANDBY) U23.23(DVDD) U24.5(*SYNC) U24.6(*RESET) U24.18(*STANDBY) U24.23(DVDD) U25.5(*SYNC) U25.6(*RESET) U25.18(*STANDBY) U25.23(DVDD) U26.5(*SYNC) U26.6(*RESET) U26.18(*STANDBY) U26.23(DVDD) U27.5(*SYNC) U27.6(*RESET) U27.18(*STANDBY) U27.23(DVDD) U28.5(*SYNC) U28.6(*RESET) U28.18(*STANDBY) U28.23(DVDD) U38.5(*SYNC) U38.6(*RESET) U38.18(*STANDBY) U38.23(DVDD) U39.5(*SYNC) U39.6(*RESET) U39.18(*STANDBY) U39.23(DVDD) U40.1(VBAT) U40.13(VDDA) U40.19(VDD_4) U40.32(VDD_1) U40.48(VDD_2) U40.64(VDD_3) U41.5(*SYNC) U41.6(*RESET) U41.18(*STANDBY) U41.23(DVDD) U42.5(*SYNC) U42.6(*RESET) U42.18(*STANDBY) U42.23(DVDD) U43.5(*SYNC) U43.6(*RESET) U43.18(*STANDBY) U43.23(DVDD) U44.5(*SYNC) U44.6(*RESET) U44.18(*STANDBY) U44.23(DVDD) U45.5(*SYNC) U45.6(*RESET) U45.18(*STANDBY) U45.23(DVDD) U46.5(*SYNC) U46.6(*RESET) U46.18(*STANDBY) U46.23(DVDD) Y3.4(VCC) Y7.4(VCC) ; also sheet 1,2,4
GND: C11.1 C12.1 C13.2 C14.2 C15.2 C16.2 C17.2 C18.2 C19.2 C20.2 C52.1 C53.1 C54.2 C55.2 C56.2 C57.2 C58.2 C59.2 C60.2 C61.2 SV10.2 SV10.5 SV21.2 SV21.5 U18.4(POL) U18.8(AGND) U18.15(REF_IN(-)) U18.24(DGND) U21.4(POL) U21.8(AGND) U21.15(REF_IN(-)) U21.24(DGND) U22.12(VSSA) U22.18(VSS_4) U22.31(VSS_1) U22.47(VSS_2) U22.63(VSS_3) U23.4(POL) U23.8(AGND) U23.15(REF_IN(-)) U23.24(DGND) U24.4(POL) U24.8(AGND) U24.15(REF_IN(-)) U24.24(DGND) U25.4(POL) U25.8(AGND) U25.15(REF_IN(-)) U25.24(DGND) U26.4(POL) U26.8(AGND) U26.15(REF_IN(-)) U26.24(DGND) U27.4(POL) U27.8(AGND) U27.15(REF_IN(-)) U27.24(DGND) U28.4(POL) U28.8(AGND) U28.15(REF_IN(-)) U28.24(DGND) U38.4(POL) U38.8(AGND) U38.15(REF_IN(-)) U38.24(DGND) U39.4(POL) U39.8(AGND) U39.15(REF_IN(-)) U39.24(DGND) U40.12(VSSA) U40.18(VSS_4) U40.31(VSS_1) U40.47(VSS_2) U40.63(VSS_3) U41.4(POL) U41.8(AGND) U41.15(REF_IN(-)) U41.24(DGND) U42.4(POL) U42.8(AGND) U42.15(REF_IN(-)) U42.24(DGND) U43.4(POL) U43.8(AGND) U43.15(REF_IN(-)) U43.24(DGND) U44.4(POL) U44.8(AGND) U44.15(REF_IN(-)) U44.24(DGND) U45.4(POL) U45.8(AGND) U45.15(REF_IN(-)) U45.24(DGND) U46.4(POL) U46.8(AGND) U46.15(REF_IN(-)) U46.24(DGND) Y3.2(GND) Y4.2(GND1) Y4.4(GND2) Y7.2(GND) Y8.2(GND1) Y8.4(GND2) ; also sheet 1,2,4
LC_1_CS0: U18.19(*CS) U22.14(PA0-WKUP)
LC_1_CS1: U21.19(*CS) U22.15(PA1)
LC_1_CS2: U22.16(PA2) U23.19(*CS)
LC_1_CS3: U22.24(PC4) U24.19(*CS)
LC_1_CS4: U22.25(PC5) U25.19(*CS)
LC_1_CS5: U22.26(PB0) U26.19(*CS)
LC_1_CS6: U22.27(PB1) U27.19(*CS)
LC_1_CS7: U22.28(PB1_2) U28.19(*CS)
LC_1_MCLK: U18.2(MCLK_IN) Y3.3(OUT)
LC_1_NRST: SV10.4 U22.7(NRST)
LC_1_OSC_IN: C18.1 U22.5(PD0_OSC_IN) Y4.1(OSC1)
LC_1_OSC_OUT: C17.1 U22.6(PD1_OSC_OUT) Y4.3(OSC2)
LC_1_PB7: U22.59(PB7)
LC_1_RDY0: U18.20(*RDY) U22.45(PA12)
LC_1_RDY1: U21.20(*RDY) U22.44(PA11)
LC_1_RDY2: U22.43(PA10) U23.20(*RDY)
LC_1_RDY3: U22.42(PA9) U24.20(*RDY)
LC_1_RDY4: U22.41(PA8) U25.20(*RDY)
LC_1_RDY5: U22.40(PC9) U26.20(*RDY)
LC_1_RDY6: U22.39(PC8) U27.20(*RDY)
LC_1_RDY7: U22.38(PC7) U28.20(*RDY)
LC_1_SPI1_MISO: U18.21(DOUT) U21.21(DOUT) U22.22(PA6) U23.21(DOUT) U24.21(DOUT) U25.21(DOUT) U26.21(DOUT) U27.21(DOUT) U28.21(DOUT)
LC_1_SPI1_MOSI: U18.22(DIN) U21.22(DIN) U22.23(PA7) U23.22(DIN) U24.22(DIN) U25.22(DIN) U26.22(DIN) U27.22(DIN) U28.22(DIN)
LC_1_SPI1_SCK: U18.1(SCLK) U21.1(SCLK) U22.21(PA5) U23.1(SCLK) U24.1(SCLK) U25.1(SCLK) U26.1(SCLK) U27.1(SCLK) U28.1(SCLK)
LC_1_SWDCLK: SV10.3 U22.49(PA14)
LC_1_SWDIO: SV10.6 U22.46(PA13)
LC_2_CS0: U38.19(*CS) U40.14(PA0-WKUP)
LC_2_CS1: U39.19(*CS) U40.15(PA1)
LC_2_CS2: U40.16(PA2) U41.19(*CS)
LC_2_CS3: U40.24(PC4) U42.19(*CS)
LC_2_CS4: U40.25(PC5) U43.19(*CS)
LC_2_CS5: U40.26(PB0) U44.19(*CS)
LC_2_CS6: U40.27(PB1) U45.19(*CS)
LC_2_CS7: U40.28(PB1_2) U46.19(*CS)
LC_2_MCLK: U38.2(MCLK_IN) Y7.3(OUT)
LC_2_NRST: SV21.4 U40.7(NRST)
LC_2_OSC_IN: C59.1 U40.5(PD0_OSC_IN) Y8.1(OSC1)
LC_2_OSC_OUT: C58.1 U40.6(PD1_OSC_OUT) Y8.3(OSC2)
LC_2_PB7: U40.59(PB7)
LC_2_RDY0: U38.20(*RDY) U40.45(PA12)
LC_2_RDY1: U39.20(*RDY) U40.44(PA11)
LC_2_RDY2: U40.43(PA10) U41.20(*RDY)
LC_2_RDY3: U40.42(PA9) U42.20(*RDY)
LC_2_RDY4: U40.41(PA8) U43.20(*RDY)
LC_2_RDY5: U40.40(PC9) U44.20(*RDY)
LC_2_RDY6: U40.39(PC8) U45.20(*RDY)
LC_2_RDY7: U40.38(PC7) U46.20(*RDY)
LC_2_SPI1_MISO: U38.21(DOUT) U39.21(DOUT) U40.22(PA6) U41.21(DOUT) U42.21(DOUT) U43.21(DOUT) U44.21(DOUT) U45.21(DOUT) U46.21(DOUT)
LC_2_SPI1_MOSI: U38.22(DIN) U39.22(DIN) U40.23(PA7) U41.22(DIN) U42.22(DIN) U43.22(DIN) U44.22(DIN) U45.22(DIN) U46.22(DIN)
LC_2_SPI1_SCK: U38.1(SCLK) U39.1(SCLK) U40.21(PA5) U41.1(SCLK) U42.1(SCLK) U43.1(SCLK) U44.1(SCLK) U45.1(SCLK) U46.1(SCLK)
LC_2_SWDCLK: SV21.3 U40.49(PA14)
LC_2_SWDIO: SV21.6 U40.46(PA13)
MISO: U22.56(PB4) U40.56(PB4) ; also sheet 1,2,4
MOSI: U22.57(PB5) U40.57(PB5) ; also sheet 1,2,4
SCLK: U22.55(PB3) U40.55(PB3) ; also sheet 1,2,4
SS_LC_1: U40.50(PA15) ; also sheet 4
SS_LC_2: U22.50(PA15) ; also sheet 4
Unconnected: U18.7(VBIAS) U18.16(ACX) U18.17(*ACX) U21.7(VBIAS) U21.16(ACX) U21.17(*ACX) U22.2(PC13-TAMPER-RTC) U22.3(PC14-OSC32_IN) U22.4(PC15-OSC32_OUT) U22.8(PC0) U22.9(PC1) U22.10(PC2) U22.11(PC3) U22.17(PA3) U22.20(PA4) U22.29(PB10) U22.30(PB11) U22.33(PB12) U22.34(PB13) U22.35(PB14) U22.36(PB15) U22.37(PC6) U22.51(PC10) U22.52(PC11) U22.53(PC12) U22.54(PD2) U22.58(PB6) U22.60(BOOT0) U22.61(PB8) U22.62(PB9) U23.7(VBIAS) U23.16(ACX) U23.17(*ACX) U24.7(VBIAS) U24.16(ACX) U24.17(*ACX) U25.7(VBIAS) U25.16(ACX) U25.17(*ACX) U26.7(VBIAS) U26.16(ACX) U26.17(*ACX) U27.7(VBIAS) U27.16(ACX) U27.17(*ACX) U28.3(MCLK_OUT) U28.7(VBIAS) U28.16(ACX) U28.17(*ACX) U38.7(VBIAS) U38.16(ACX) U38.17(*ACX) U39.7(VBIAS) U39.16(ACX) U39.17(*ACX) U40.2(PC13-TAMPER-RTC) U40.3(PC14-OSC32_IN) U40.4(PC15-OSC32_OUT) U40.8(PC0) U40.9(PC1) U40.10(PC2) U40.11(PC3) U40.17(PA3) U40.20(PA4) U40.29(PB10) U40.30(PB11) U40.33(PB12) U40.34(PB13) U40.35(PB14) U40.36(PB15) U40.37(PC6) U40.51(PC10) U40.52(PC11) U40.53(PC12) U40.54(PD2) U40.58(PB6) U40.60(BOOT0) U40.61(PB8) U40.62(PB9) U41.7(VBIAS) U41.16(ACX) U41.17(*ACX) U42.7(VBIAS) U42.16(ACX) U42.17(*ACX) U43.7(VBIAS) U43.16(ACX) U43.17(*ACX) U44.7(VBIAS) U44.16(ACX) U44.17(*ACX) U45.7(VBIAS) U45.16(ACX) U45.17(*ACX) U46.3(MCLK_OUT) U46.7(VBIAS) U46.16(ACX) U46.17(*ACX) Y3.1(EN) Y7.1(EN)

## Sheet 4 of 4: Connectors
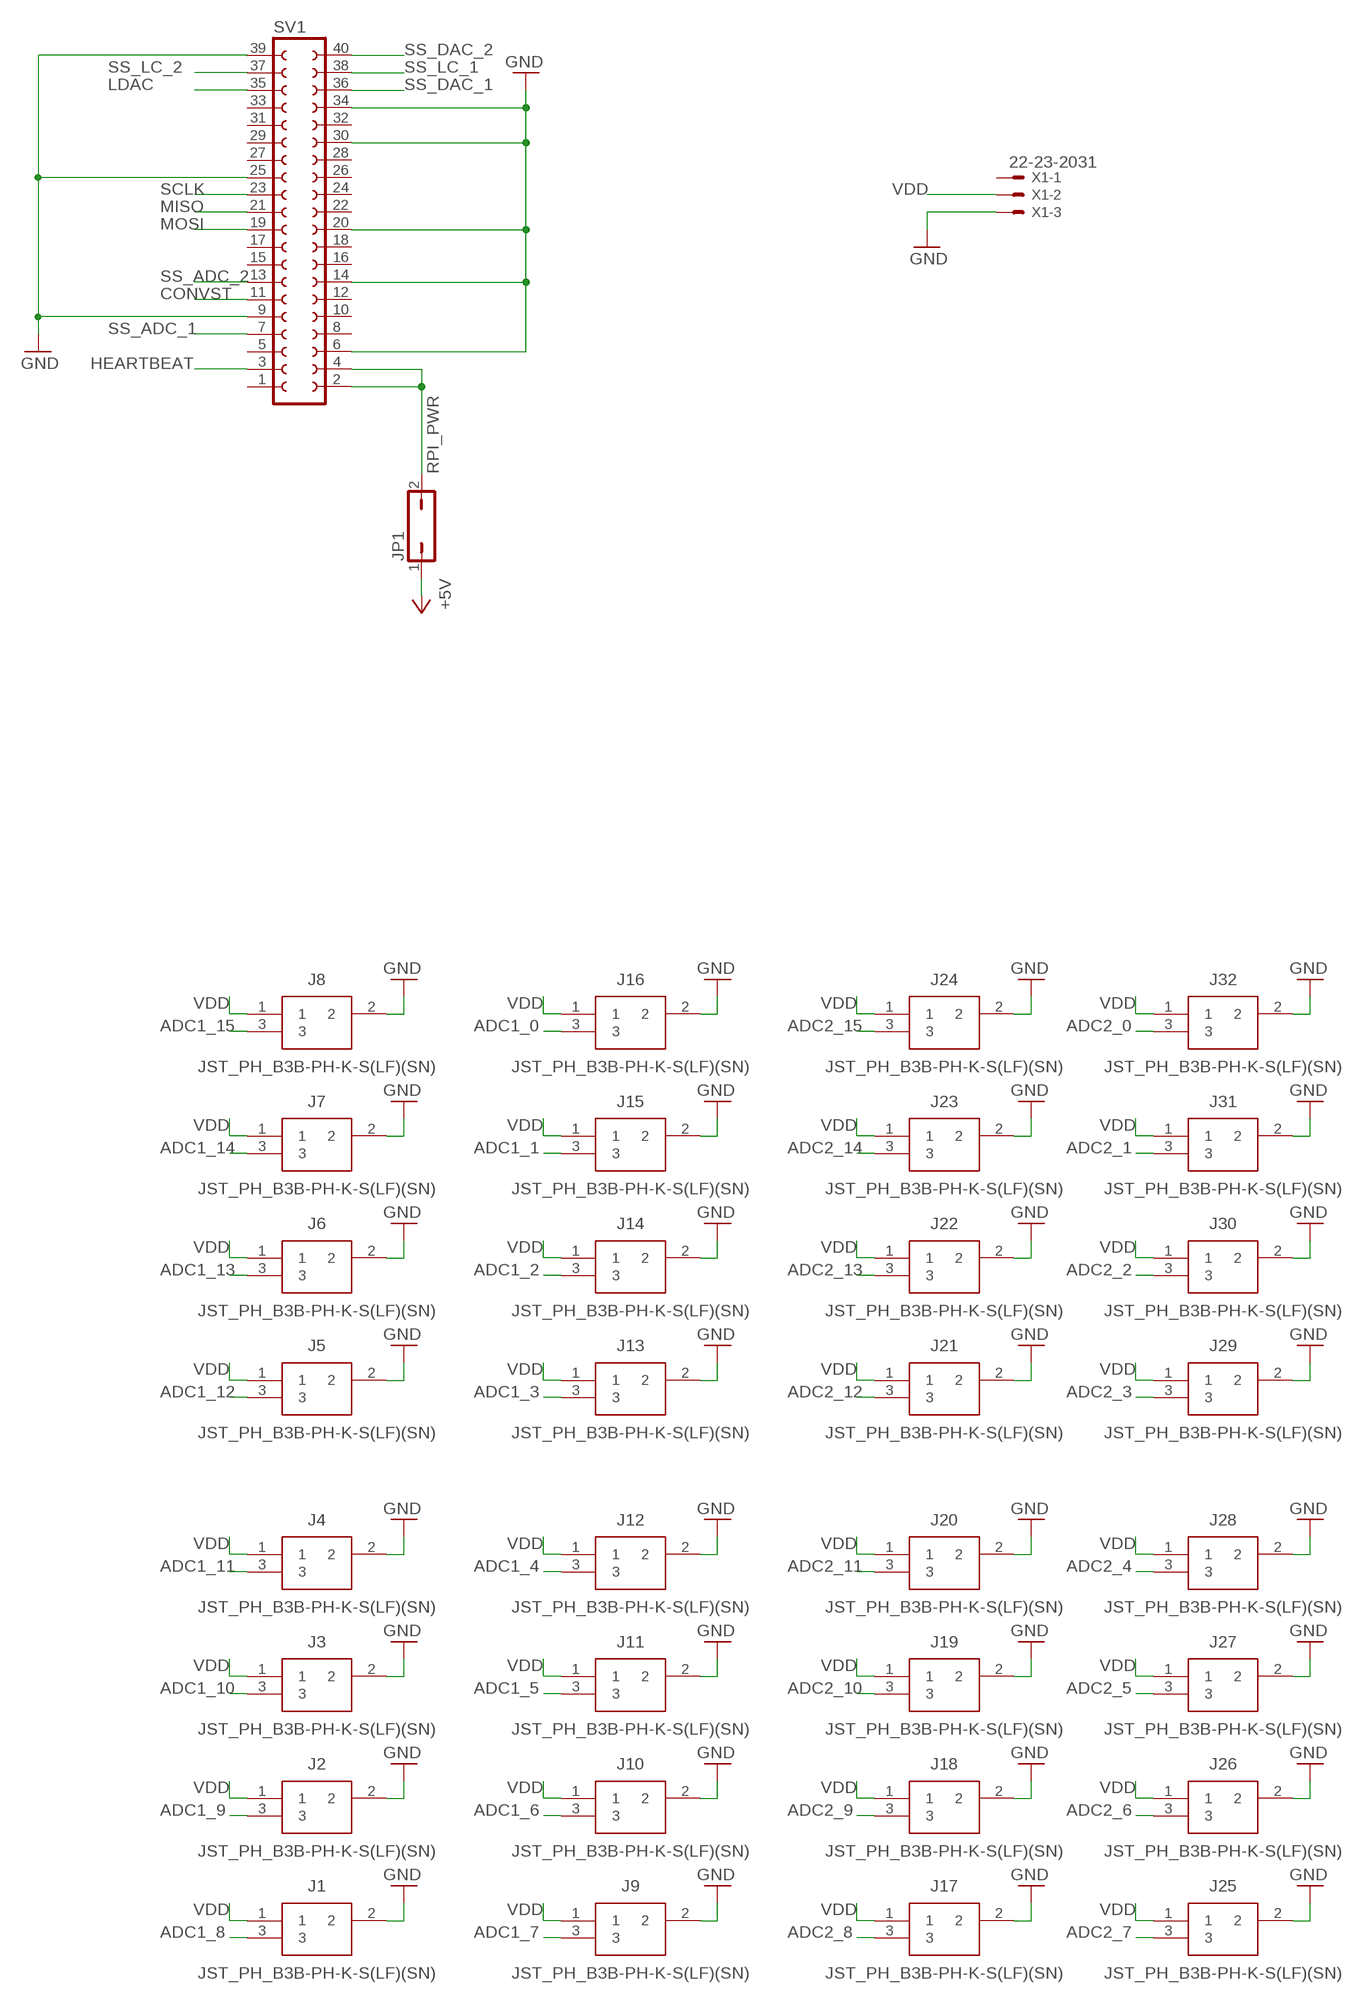
[diagram p9: schematic, sheet 4, part 1 of 2]
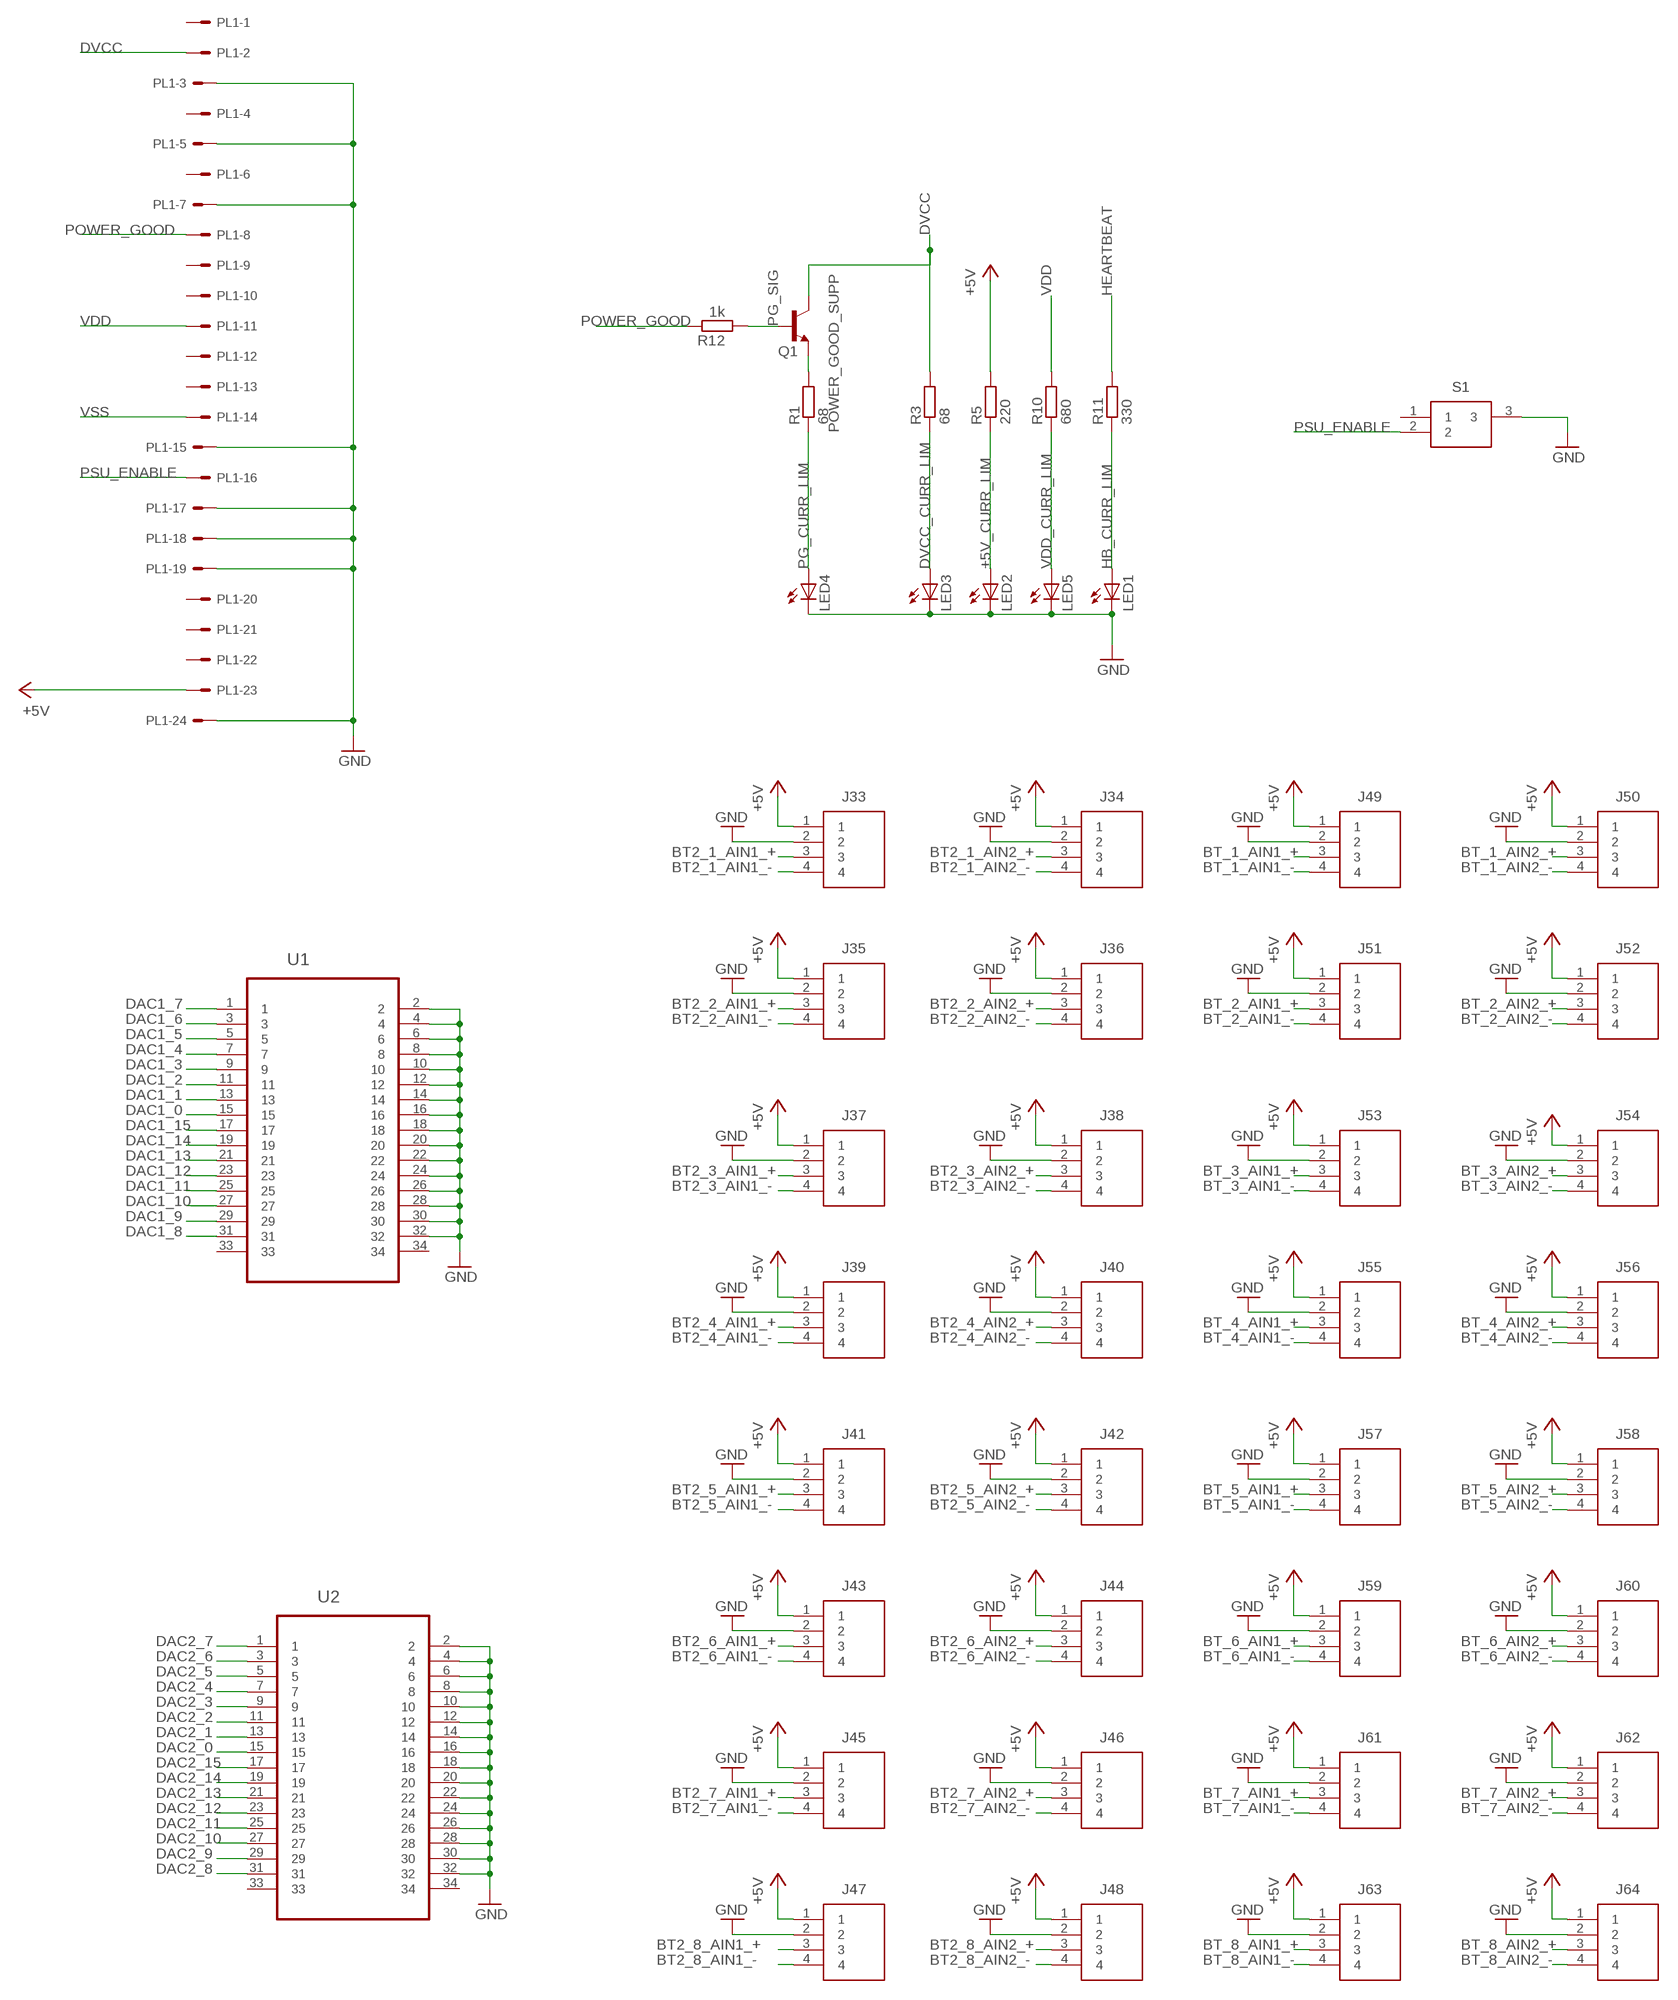
[diagram p10: schematic, sheet 4, part 2 of 2]

### Parts
J1  JST_PH_B3B-PH-K-S(LF)(SN)  [JST_PH_SHDR3W50P0X200_1X3_790X450X600]
J2  JST_PH_B3B-PH-K-S(LF)(SN)  [JST_PH_SHDR3W50P0X200_1X3_790X450X600]
J3  JST_PH_B3B-PH-K-S(LF)(SN)  [JST_PH_SHDR3W50P0X200_1X3_790X450X600]
J4  JST_PH_B3B-PH-K-S(LF)(SN)  [JST_PH_SHDR3W50P0X200_1X3_790X450X600]
J5  JST_PH_B3B-PH-K-S(LF)(SN)  [JST_PH_SHDR3W50P0X200_1X3_790X450X600]
J6  JST_PH_B3B-PH-K-S(LF)(SN)  [JST_PH_SHDR3W50P0X200_1X3_790X450X600]
J7  JST_PH_B3B-PH-K-S(LF)(SN)  [JST_PH_SHDR3W50P0X200_1X3_790X450X600]
J8  JST_PH_B3B-PH-K-S(LF)(SN)  [JST_PH_SHDR3W50P0X200_1X3_790X450X600]
J9  JST_PH_B3B-PH-K-S(LF)(SN)  [JST_PH_SHDR3W50P0X200_1X3_790X450X600]
J10  JST_PH_B3B-PH-K-S(LF)(SN)  [JST_PH_SHDR3W50P0X200_1X3_790X450X600]
J11  JST_PH_B3B-PH-K-S(LF)(SN)  [JST_PH_SHDR3W50P0X200_1X3_790X450X600]
J12  JST_PH_B3B-PH-K-S(LF)(SN)  [JST_PH_SHDR3W50P0X200_1X3_790X450X600]
J13  JST_PH_B3B-PH-K-S(LF)(SN)  [JST_PH_SHDR3W50P0X200_1X3_790X450X600]
J14  JST_PH_B3B-PH-K-S(LF)(SN)  [JST_PH_SHDR3W50P0X200_1X3_790X450X600]
J15  JST_PH_B3B-PH-K-S(LF)(SN)  [JST_PH_SHDR3W50P0X200_1X3_790X450X600]
J16  JST_PH_B3B-PH-K-S(LF)(SN)  [JST_PH_SHDR3W50P0X200_1X3_790X450X600]
J17  JST_PH_B3B-PH-K-S(LF)(SN)  [JST_PH_SHDR3W50P0X200_1X3_790X450X600]
J18  JST_PH_B3B-PH-K-S(LF)(SN)  [JST_PH_SHDR3W50P0X200_1X3_790X450X600]
J19  JST_PH_B3B-PH-K-S(LF)(SN)  [JST_PH_SHDR3W50P0X200_1X3_790X450X600]
J20  JST_PH_B3B-PH-K-S(LF)(SN)  [JST_PH_SHDR3W50P0X200_1X3_790X450X600]
J21  JST_PH_B3B-PH-K-S(LF)(SN)  [JST_PH_SHDR3W50P0X200_1X3_790X450X600]
J22  JST_PH_B3B-PH-K-S(LF)(SN)  [JST_PH_SHDR3W50P0X200_1X3_790X450X600]
J23  JST_PH_B3B-PH-K-S(LF)(SN)  [JST_PH_SHDR3W50P0X200_1X3_790X450X600]
J24  JST_PH_B3B-PH-K-S(LF)(SN)  [JST_PH_SHDR3W50P0X200_1X3_790X450X600]
J25  JST_PH_B3B-PH-K-S(LF)(SN)  [JST_PH_SHDR3W50P0X200_1X3_790X450X600]
J26  JST_PH_B3B-PH-K-S(LF)(SN)  [JST_PH_SHDR3W50P0X200_1X3_790X450X600]
J27  JST_PH_B3B-PH-K-S(LF)(SN)  [JST_PH_SHDR3W50P0X200_1X3_790X450X600]
J28  JST_PH_B3B-PH-K-S(LF)(SN)  [JST_PH_SHDR3W50P0X200_1X3_790X450X600]
J29  JST_PH_B3B-PH-K-S(LF)(SN)  [JST_PH_SHDR3W50P0X200_1X3_790X450X600]
J30  JST_PH_B3B-PH-K-S(LF)(SN)  [JST_PH_SHDR3W50P0X200_1X3_790X450X600]
J31  JST_PH_B3B-PH-K-S(LF)(SN)  [JST_PH_SHDR3W50P0X200_1X3_790X450X600]
J32  JST_PH_B3B-PH-K-S(LF)(SN)  [JST_PH_SHDR3W50P0X200_1X3_790X450X600]
J33  B4B-PH-K-S(LF)(SN)  [SHDR4W50P0X200_1X4_990X450X600]
J34  B4B-PH-K-S(LF)(SN)  [SHDR4W50P0X200_1X4_990X450X600]
J35  B4B-PH-K-S(LF)(SN)  [SHDR4W50P0X200_1X4_990X450X600]
J36  B4B-PH-K-S(LF)(SN)  [SHDR4W50P0X200_1X4_990X450X600]
J37  B4B-PH-K-S(LF)(SN)  [SHDR4W50P0X200_1X4_990X450X600]
J38  B4B-PH-K-S(LF)(SN)  [SHDR4W50P0X200_1X4_990X450X600]
J39  B4B-PH-K-S(LF)(SN)  [SHDR4W50P0X200_1X4_990X450X600]
J40  B4B-PH-K-S(LF)(SN)  [SHDR4W50P0X200_1X4_990X450X600]
J41  B4B-PH-K-S(LF)(SN)  [SHDR4W50P0X200_1X4_990X450X600]
J42  B4B-PH-K-S(LF)(SN)  [SHDR4W50P0X200_1X4_990X450X600]
J43  B4B-PH-K-S(LF)(SN)  [SHDR4W50P0X200_1X4_990X450X600]
J44  B4B-PH-K-S(LF)(SN)  [SHDR4W50P0X200_1X4_990X450X600]
J45  B4B-PH-K-S(LF)(SN)  [SHDR4W50P0X200_1X4_990X450X600]
J46  B4B-PH-K-S(LF)(SN)  [SHDR4W50P0X200_1X4_990X450X600]
J47  B4B-PH-K-S(LF)(SN)  [SHDR4W50P0X200_1X4_990X450X600]
J48  B4B-PH-K-S(LF)(SN)  [SHDR4W50P0X200_1X4_990X450X600]
J49  B4B-PH-K-S(LF)(SN)  [SHDR4W50P0X200_1X4_990X450X600]
J50  B4B-PH-K-S(LF)(SN)  [SHDR4W50P0X200_1X4_990X450X600]
J51  B4B-PH-K-S(LF)(SN)  [SHDR4W50P0X200_1X4_990X450X600]
J52  B4B-PH-K-S(LF)(SN)  [SHDR4W50P0X200_1X4_990X450X600]
J53  B4B-PH-K-S(LF)(SN)  [SHDR4W50P0X200_1X4_990X450X600]
J54  B4B-PH-K-S(LF)(SN)  [SHDR4W50P0X200_1X4_990X450X600]
J55  B4B-PH-K-S(LF)(SN)  [SHDR4W50P0X200_1X4_990X450X600]
J56  B4B-PH-K-S(LF)(SN)  [SHDR4W50P0X200_1X4_990X450X600]
J57  B4B-PH-K-S(LF)(SN)  [SHDR4W50P0X200_1X4_990X450X600]
J58  B4B-PH-K-S(LF)(SN)  [SHDR4W50P0X200_1X4_990X450X600]
J59  B4B-PH-K-S(LF)(SN)  [SHDR4W50P0X200_1X4_990X450X600]
J60  B4B-PH-K-S(LF)(SN)  [SHDR4W50P0X200_1X4_990X450X600]
J61  B4B-PH-K-S(LF)(SN)  [SHDR4W50P0X200_1X4_990X450X600]
J62  B4B-PH-K-S(LF)(SN)  [SHDR4W50P0X200_1X4_990X450X600]
J63  B4B-PH-K-S(LF)(SN)  [SHDR4W50P0X200_1X4_990X450X600]
J64  B4B-PH-K-S(LF)(SN)  [SHDR4W50P0X200_1X4_990X450X600]
JP1  JP1Q  [JP1]
LED1  LEDCHIP-LED0603  [CHIP-LED0603]
LED2  LEDCHIP-LED0603  [CHIP-LED0603]
LED3  LEDCHIP-LED0603  [CHIP-LED0603]
LED4  LEDCHIP-LED0603  [CHIP-LED0603]
LED5  LEDCHIP-LED0603  [CHIP-LED0603]
PL1  555X-24V  [5566-24]
Q1  BCF29SMD  [SOT23-BEC]
R1  68  R-EU_R0805  [R0805]
R3  68  R-EU_R0805  [R0805]
R5  220  R-EU_R0805  [R0805]
R10  680  R-EU_R0805  [R0805]
R11  330  R-EU_R0805  [R0805]
R12  1k  R-EU_R0805  [R0805]
S1  1MS1T1B1M2QES-5  [1MS1T1B1M2QES-5]
SV1  FE20-2  [FE20-2]
U1  AMP-5103309-7-34PIN_5103309-7  [AMP-5103309-7-34PIN_TYCO_5103309-7]
U2  AMP-5103309-7-34PIN_5103309-7  [AMP-5103309-7-34PIN_TYCO_5103309-7]
X1  22-23-2031  [22-23-2031]

### Nets
+5V: J33.1 J34.1 J35.1 J36.1 J37.1 J38.1 J39.1 J40.1 J41.1 J42.1 J43.1 J44.1 J45.1 J46.1 J47.1 J48.1 J49.1 J50.1 J51.1 J52.1 J53.1 J54.1 J55.1 J56.1 J57.1 J58.1 J59.1 J60.1 J61.1 J62.1 J63.1 J64.1 JP1.1 PL1.23 R5.2 ; also sheet 1,3
+5V_CURR_LIM: LED2.A R5.1
ADC1_0: J16.3 ; also sheet 1
ADC1_1: J15.3 ; also sheet 1
ADC1_2: J14.3 ; also sheet 1
ADC1_3: J13.3 ; also sheet 1
ADC1_4: J12.3 ; also sheet 1
ADC1_5: J11.3 ; also sheet 1
ADC1_6: J10.3 ; also sheet 1
ADC1_7: J9.3 ; also sheet 1
ADC1_8: J1.3 ; also sheet 1
ADC1_9: J2.3 ; also sheet 1
ADC1_10: J3.3 ; also sheet 1
ADC1_11: J4.3 ; also sheet 1
ADC1_12: J5.3 ; also sheet 1
ADC1_13: J6.3 ; also sheet 1
ADC1_14: J7.3 ; also sheet 1
ADC1_15: J8.3 ; also sheet 1
ADC2_0: J32.3 ; also sheet 1
ADC2_1: J31.3 ; also sheet 1
ADC2_2: J30.3 ; also sheet 1
ADC2_3: J29.3 ; also sheet 1
ADC2_4: J28.3 ; also sheet 1
ADC2_5: J27.3 ; also sheet 1
ADC2_6: J26.3 ; also sheet 1
ADC2_7: J25.3 ; also sheet 1
ADC2_8: J17.3 ; also sheet 1
ADC2_9: J18.3 ; also sheet 1
ADC2_10: J19.3 ; also sheet 1
ADC2_11: J20.3 ; also sheet 1
ADC2_12: J21.3 ; also sheet 1
ADC2_13: J22.3 ; also sheet 1
ADC2_14: J23.3 ; also sheet 1
ADC2_15: J24.3 ; also sheet 1
BT2_1_AIN1_+: J33.3 ; also sheet 3
BT2_1_AIN1_-: J33.4 ; also sheet 3
BT2_1_AIN2_+: J34.3 ; also sheet 3
BT2_1_AIN2_-: J34.4 ; also sheet 3
BT2_2_AIN1_+: J35.3 ; also sheet 3
BT2_2_AIN1_-: J35.4 ; also sheet 3
BT2_2_AIN2_+: J36.3 ; also sheet 3
BT2_2_AIN2_-: J36.4 ; also sheet 3
BT2_3_AIN1_+: J37.3 ; also sheet 3
BT2_3_AIN1_-: J37.4 ; also sheet 3
BT2_3_AIN2_+: J38.3 ; also sheet 3
BT2_3_AIN2_-: J38.4 ; also sheet 3
BT2_4_AIN1_+: J39.3 ; also sheet 3
BT2_4_AIN1_-: J39.4 ; also sheet 3
BT2_4_AIN2_+: J40.3 ; also sheet 3
BT2_4_AIN2_-: J40.4 ; also sheet 3
BT2_5_AIN1_+: J41.3 ; also sheet 3
BT2_5_AIN1_-: J41.4 ; also sheet 3
BT2_5_AIN2_+: J42.3 ; also sheet 3
BT2_5_AIN2_-: J42.4 ; also sheet 3
BT2_6_AIN1_+: J43.3 ; also sheet 3
BT2_6_AIN1_-: J43.4 ; also sheet 3
BT2_6_AIN2_+: J44.3 ; also sheet 3
BT2_6_AIN2_-: J44.4 ; also sheet 3
BT2_7_AIN1_+: J45.3 ; also sheet 3
BT2_7_AIN1_-: J45.4 ; also sheet 3
BT2_7_AIN2_+: J46.3 ; also sheet 3
BT2_7_AIN2_-: J46.4 ; also sheet 3
BT2_8_AIN1_+: J47.3 ; also sheet 3
BT2_8_AIN1_-: J47.4 ; also sheet 3
BT2_8_AIN2_+: J48.3 ; also sheet 3
BT2_8_AIN2_-: J48.4 ; also sheet 3
BT_1_AIN1_+: J49.3 ; also sheet 3
BT_1_AIN1_-: J49.4 ; also sheet 3
BT_1_AIN2_+: J50.3 ; also sheet 3
BT_1_AIN2_-: J50.4 ; also sheet 3
BT_2_AIN1_+: J51.3 ; also sheet 3
BT_2_AIN1_-: J51.4 ; also sheet 3
BT_2_AIN2_+: J52.3 ; also sheet 3
BT_2_AIN2_-: J52.4 ; also sheet 3
BT_3_AIN1_+: J53.3 ; also sheet 3
BT_3_AIN1_-: J53.4 ; also sheet 3
BT_3_AIN2_+: J54.3 ; also sheet 3
BT_3_AIN2_-: J54.4 ; also sheet 3
BT_4_AIN1_+: J55.3 ; also sheet 3
BT_4_AIN1_-: J55.4 ; also sheet 3
BT_4_AIN2_+: J56.3 ; also sheet 3
BT_4_AIN2_-: J56.4 ; also sheet 3
BT_5_AIN1_+: J57.3 ; also sheet 3
BT_5_AIN1_-: J57.4 ; also sheet 3
BT_5_AIN2_+: J58.3 ; also sheet 3
BT_5_AIN2_-: J58.4 ; also sheet 3
BT_6_AIN1_+: J59.3 ; also sheet 3
BT_6_AIN1_-: J59.4 ; also sheet 3
BT_6_AIN2_+: J60.3 ; also sheet 3
BT_6_AIN2_-: J60.4 ; also sheet 3
BT_7_AIN1_+: J61.3 ; also sheet 3
BT_7_AIN1_-: J61.4 ; also sheet 3
BT_7_AIN2_+: J62.3 ; also sheet 3
BT_7_AIN2_-: J62.4 ; also sheet 3
BT_8_AIN1_+: J63.3 ; also sheet 3
BT_8_AIN1_-: J63.4 ; also sheet 3
BT_8_AIN2_+: J64.3 ; also sheet 3
BT_8_AIN2_-: J64.4 ; also sheet 3
CONVST: SV1.11 ; also sheet 1
DAC1_0: U1.15 ; also sheet 2
DAC1_1: U1.13 ; also sheet 2
DAC1_2: U1.11 ; also sheet 2
DAC1_3: U1.9 ; also sheet 2
DAC1_4: U1.7 ; also sheet 2
DAC1_5: U1.5 ; also sheet 2
DAC1_6: U1.3 ; also sheet 2
DAC1_7: U1.1 ; also sheet 2
DAC1_8: U1.31 ; also sheet 2
DAC1_9: U1.29 ; also sheet 2
DAC1_10: U1.27 ; also sheet 2
DAC1_11: U1.25 ; also sheet 2
DAC1_12: U1.23 ; also sheet 2
DAC1_13: U1.21 ; also sheet 2
DAC1_14: U1.19 ; also sheet 2
DAC1_15: U1.17 ; also sheet 2
DAC2_0: U2.15 ; also sheet 2
DAC2_1: U2.13 ; also sheet 2
DAC2_2: U2.11 ; also sheet 2
DAC2_3: U2.9 ; also sheet 2
DAC2_4: U2.7 ; also sheet 2
DAC2_5: U2.5 ; also sheet 2
DAC2_6: U2.3 ; also sheet 2
DAC2_7: U2.1 ; also sheet 2
DAC2_8: U2.31 ; also sheet 2
DAC2_9: U2.29 ; also sheet 2
DAC2_10: U2.27 ; also sheet 2
DAC2_11: U2.25 ; also sheet 2
DAC2_12: U2.23 ; also sheet 2
DAC2_13: U2.21 ; also sheet 2
DAC2_14: U2.19 ; also sheet 2
DAC2_15: U2.17 ; also sheet 2
DVCC: PL1.2 Q1.C R3.2 ; also sheet 1,2,3
DVCC_CURR_LIM: LED3.A R3.1
GND: J1.2 J2.2 J3.2 J4.2 J5.2 J6.2 J7.2 J8.2 J9.2 J10.2 J11.2 J12.2 J13.2 J14.2 J15.2 J16.2 J17.2 J18.2 J19.2 J20.2 J21.2 J22.2 J23.2 J24.2 J25.2 J26.2 J27.2 J28.2 J29.2 J30.2 J31.2 J32.2 J33.2 J34.2 J35.2 J36.2 J37.2 J38.2 J39.2 J40.2 J41.2 J42.2 J43.2 J44.2 J45.2 J46.2 J47.2 J48.2 J49.2 J50.2 J51.2 J52.2 J53.2 J54.2 J55.2 J56.2 J57.2 J58.2 J59.2 J60.2 J61.2 J62.2 J63.2 J64.2 LED1.C LED2.C LED3.C LED4.C LED5.C PL1.3 PL1.5 PL1.7 PL1.15 PL1.17 PL1.18 PL1.19 PL1.24 S1.3 SV1.6 SV1.9 SV1.14 SV1.20 SV1.25 SV1.30 SV1.34 SV1.39 U1.2 U1.4 U1.6 U1.8 U1.10 U1.12 U1.14 U1.16 U1.18 U1.20 U1.22 U1.24 U1.26 U1.28 U1.30 U1.32 U2.2 U2.4 U2.6 U2.8 U2.10 U2.12 U2.14 U2.16 U2.18 U2.20 U2.22 U2.24 U2.26 U2.28 U2.30 U2.32 X1.3 ; also sheet 1,2,3
HB_CURR_LIM: LED1.A R11.1
HEARTBEAT: R11.2 SV1.3
LDAC: SV1.35 ; also sheet 2
MISO: SV1.21 ; also sheet 1,2,3
MOSI: SV1.19 ; also sheet 1,2,3
PG_CURR_LIM: LED4.A R1.1
PG_SIG: Q1.B R12.1
POWER_GOOD: PL1.8 R12.2
POWER_GOOD_SUPP: Q1.E R1.2
PSU_ENABLE: PL1.16 S1.2
RPI_PWR: JP1.2 SV1.2 SV1.4
SCLK: SV1.23 ; also sheet 1,2,3
SS_ADC_1: SV1.7 ; also sheet 1
SS_ADC_2: SV1.13 ; also sheet 1
SS_DAC_1: SV1.36 ; also sheet 2
SS_DAC_2: SV1.40 ; also sheet 2
SS_LC_1: SV1.38 ; also sheet 3
SS_LC_2: SV1.37 ; also sheet 3
VDD: J1.1 J2.1 J3.1 J4.1 J5.1 J6.1 J7.1 J8.1 J9.1 J10.1 J11.1 J12.1 J13.1 J14.1 J15.1 J16.1 J17.1 J18.1 J19.1 J20.1 J21.1 J22.1 J23.1 J24.1 J25.1 J26.1 J27.1 J28.1 J29.1 J30.1 J31.1 J32.1 PL1.11 R10.2 X1.2 ; also sheet 1,2
VDD_CURR_LIM: LED5.A R10.1
VSS: PL1.14 ; also sheet 2
Unconnected: PL1.1 PL1.4 PL1.6 PL1.9 PL1.10 PL1.12 PL1.13 PL1.20 PL1.21 PL1.22 S1.1 SV1.1 SV1.5 SV1.8 SV1.10 SV1.12 SV1.15 SV1.16 SV1.17 SV1.18 SV1.22 SV1.24 SV1.26 SV1.27 SV1.28 SV1.29 SV1.31 SV1.32 SV1.33 U1.33 U1.34 U2.33 U2.34 X1.1

## Library data of the parts
C1-C10 C21-C30 = resistor:CPOL-EU: POLARIZED CAPACITOR, European symbol
C11-C20 C32 C33 C35 C36 C38-C64 C66 C67 C69-C83 C102 C103 C107 C109 C111 C113 C114 C116 C117 C136 C137 C141 C143 C145 C147 C148 C150 C151 = rcl:C-EU: CAPACITOR, European symbol
J1-J32 = RPi_Extension_contr_sens_conn_board:JST_PH_B3B-PH-K-S(LF)(SN): PH-2.0mm Header top entry 3 way JST PH Series, Series Number B3B, 2mm Pitch 3 Way 1 Row Straight PCB Header, Through Hole Termination, 2A <https://componentsearchengine.com/Images/3/B3B-PH-K-S%28LF%29%28SN%29.jpg> Source: Datasheet <http://uk.rs-online.com/web/p/products/8201431>; DESCRIPTION: PH-2.0mm Header top entry 3 way JST PH Series, Series Number B3B, 2mm Pitch 3 Way 1 Row Straight PCB Header, Through Hole Termination, 2A; HEIGHT: 6mm; MANUFACTURER_NAME: JST (JAPAN SOLDERLESS TERMINALS); MANUFACTURER_PART_NUMBER: B3B-PH-K-S(LF)(SN); RS_PART_NUMBER: 8201431P; SUPPLIER_NAME: RS
J33-J64 = B4B-PH-K-S(LF)(SN):B4B-PH-K-S(LF)(SN): PH-2.0mm Header top entry 4 way JST PH Series, Series Number B4B, 2mm Pitch 4 Way 1 Row Straight PCB Header, Through Hole Termination, 2A <https://componentsearchengine.com/Images/3/B4B-PH-K-S%28LF%29%28SN%29.jpg> Source: Datasheet <http://docs-europe.electrocomponents.com/webdocs/1347/0900766b81347511.pdf>; DESCRIPTION: PH-2.0mm Header top entry 4 way JST PH Series, Series Number B4B, 2mm Pitch 4 Way 1 Row Straight PCB Header, Through Hole Termination, 2A; HEIGHT: 6mm; MANUFACTURER_NAME: JST (JAPAN SOLDERLESS TERMINALS); MANUFACTURER_PART_NUMBER: B4B-PH-K-S(LF)(SN); RS_PART_NUMBER: 8201434P; SUPPLIER_NAME: RS
JP1 = jumper:JP1Q: JUMPER
LED1-LED5 = led:LED: LED OSRAM: - CHIPLED LG R971, LG N971, LY N971, LG Q971, LY Q971, LO R971, LY R971 LH N974, LH R974 LS Q976, LO Q976, LY Q976 LO Q996 - Hyper CHIPLED LW Q18S LB Q993, LB Q99A, LB R99A - SideLED LS A670, LO A670, LY A670, LG A670, LP A670 LB A673, LV A673, LT A673, LW A673 LH A674 LY A675 LS A676, LA A676, LO A676, LY A676, LW A676 LS A679, LY A679, LG A679 - Hyper Micro SIDELED® LS Y876, LA Y876, LO Y876, LY Y876 LT Y87S - SmartLED LW L88C, LW L88S LB L89C, LB L89S, LG L890 LS L89K, LO L89K, LY L89K LS L896, LA L896, LO L896, LY L896 - TOPLED LS T670, LO T670, LY T670, LG T670, LP T670 LSG T670, LSP T670, LSY T670, LOP T670, LYG T670 LG T671, LOG T671, LSG T671 LB T673, LV T673, LT T673, LW T673 LH T674 LS T676, LA T676, LO T676, LY T676, LB T676, LH T676, LSB T676, LW T676 LB T67C, LV T67C, LT T67C, LS T67K, LO T67K, LY T67K, LW E67C LS E67B, LA E67B, LO E67B, LY E67B, LB E67C, LV E67C, LT E67C LW T67C LS T679, LY T679, LG T679 LS T770, LO T770, LY T770, LG T770, LP T770 LB T773, LV T773, LT T773, LW T773 LH T774 LS E675, LA E675, LY E675, LS T675 LS T776, LA T776, LO T776, LY T776, LB T776 LHGB T686 LT T68C, LB T68C - Hyper Mini TOPLED® LB M676 - Mini TOPLED Santana® LG M470 LS M47K, LO M47K, LY M47K Source: http://www.osram.convergy.de LUXEON: - LUMILED® LXK2-PW12-R00, LXK2-PW12-S00, LXK2-PW14-U00, LXK2-PW14-V00 LXK2-PM12-R00, LXK2-PM12-S00, LXK2-PM14-U00 LXK2-PE12-Q00, LXK2-PE12-R00, LXK2-PE12-S00, LXK2-PE14-T00, LXK2-PE14-U00 LXK2-PB12-K00, LXK2-PB12-L00, LXK2-PB12-M00, LXK2-PB14-N00, LXK2-PB14-P00, LXK2-PB14-Q00 LXK2-PR12-L00, LXK2-PR12-M00, LXK2-PR14-Q00, LXK2-PR14-R00 LXK2-PD12-Q00, LXK2-PD12-R00, LXK2-PD12-S00 LXK2-PH12-R00, LXK2-PH12-S00 LXK2-PL12-P00, LXK2-PL12-Q00, LXK2-PL12-R00 Source: www.luxeon.com KINGBRIGHT: KA-3528ASYC Source: www.kingbright.com
PL1 = con-molex-2:555X-24: Mini FIT connector 24 way
Q1 = transistor-npn:BCF29*: NPN Transistor
R1-R12 R15 R16 R19 R20 = resistor:R-EU_: RESISTOR, European symbol
S1 = 1MS1T1B1M2QES-5:1MS1T1B1M2QES-5: Toggle switch,SP,on-none-on,PC thru-hole Toggle Switch SPDT On-On, 5 A @ 250 V ac, PCB <https://componentsearchengine.com/Images/3/1MS1T1B1M2QES-5.jpg> Source: Datasheet <http://uk.rs-online.com/web/p/products/7347066>; DESCRIPTION: Toggle switch,SP,on-none-on,PC thru-hole Toggle Switch SPDT On-On, 5 A @ 250 V ac, PCB; HEIGHT: mm; MANUFACTURER_NAME: RS Components; MANUFACTURER_PART_NUMBER: 1MS1T1B1M2QES-5; RS_PART_NUMBER: 7347066P; SUPPLIER_NAME: RS
S2 S3 S6 S8 = switch-omron:10-XX: OMRON SWITCH; MPN: B3F-1000; OC_FARNELL: 176432; OC_NEWARK: 36M3542
SV1 = con-lsta:FE20-2: FEMALE HEADER; OC_FARNELL: unknown; OC_NEWARK: unknown
SV10 SV21 = con-lstb:MA03-2: PIN HEADER; OC_FARNELL: unknown; OC_NEWARK: unknown
U1 U2 = RPi_Extension_contr_sens_conn_board:AMP-5103309-7-34PIN_5103309-7: WIRE-BOARD CONN, HEADER, 34POS; MPN: 5103309-7; OC_FARNELL: 1425170; OC_NEWARK: 02M6713; PACKAGE: 34 WAY HEADER; SUPPLIER: TycoElectronics
U4 U7 U16 U20 = ADR423ARZ:ADR423ARZ; MANUFACTURER_PART_NUMBER: ADR423ARZ; VENDOR: Vendor
U5 U8 = AD7616BSTZ:AD7616BSTZ
U6 U9 = 74AHC1G04GW:74AHC1G04GW/T1: Inverter; MPN: 74AHC1G04GW/T1; OC_FARNELL: 1085239; OC_NEWARK: 99K0513; PACKAGE: SOT353-1-5; SUPPLIER: NXP
U15 U19 = AD5360BSTZ:AD5360BSTZ
U18 U21 U23-U28 U38 U39 U41-U46 = AD7730BRUZ:AD7730BRUZ
U22 U40 = STM32F103RCT6:STM32F103RCT6: ARM-based 32-bit MCU; MPN: STM32F103RCT6; OC_FARNELL: 1624136; OC_NEWARK: 01P4099; PACKAGE: QFP-64; SUPPLIER: STMICROELECTRONICS
X1 = con-molex:22-23-2031: .100" (2.54mm) Center Header - 3 Pin; MF: MOLEX; MPN: 22-23-2031; OC_FARNELL: 1462950; OC_NEWARK: 30C0862
Y3 Y7 = kc2520b_c1:KC2520B-C1
Y4 Y8 = ABM3B:ABM3B